# EAGLE design newrev (EAGLE 9.6.2)

## Sheet 1 of 2
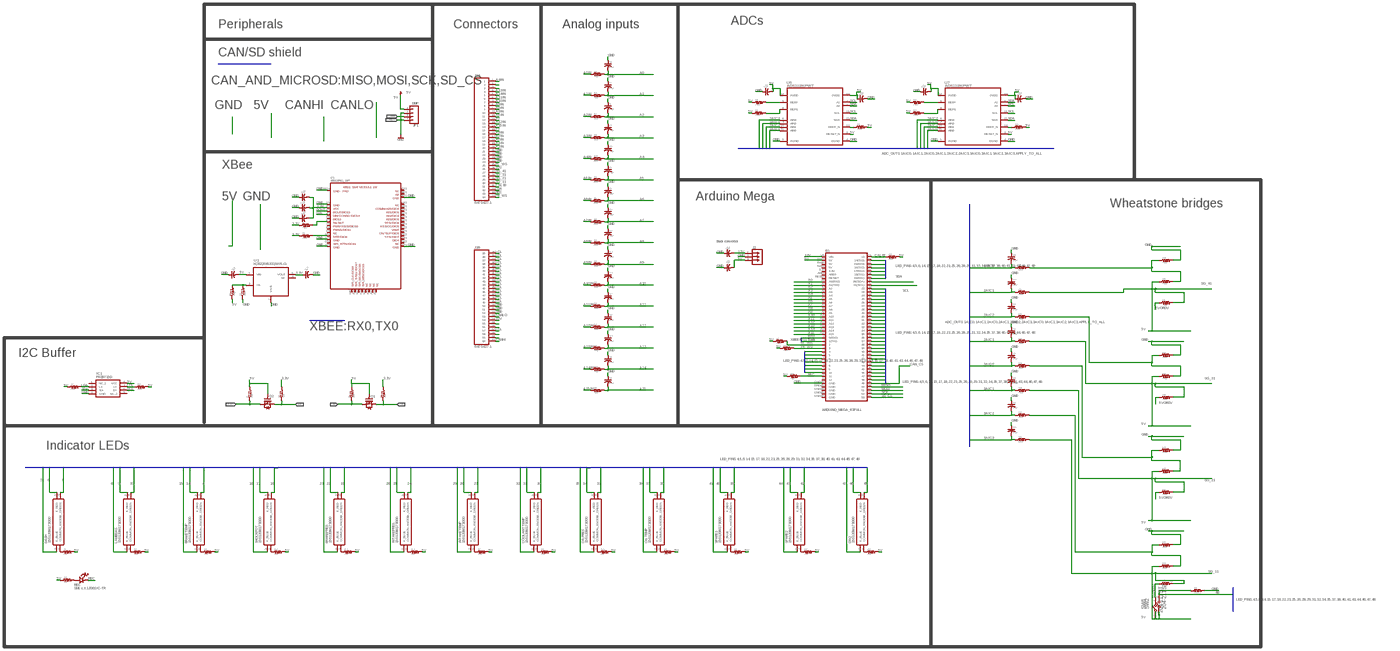
[diagram p0: schematic, sheet 1, overview]
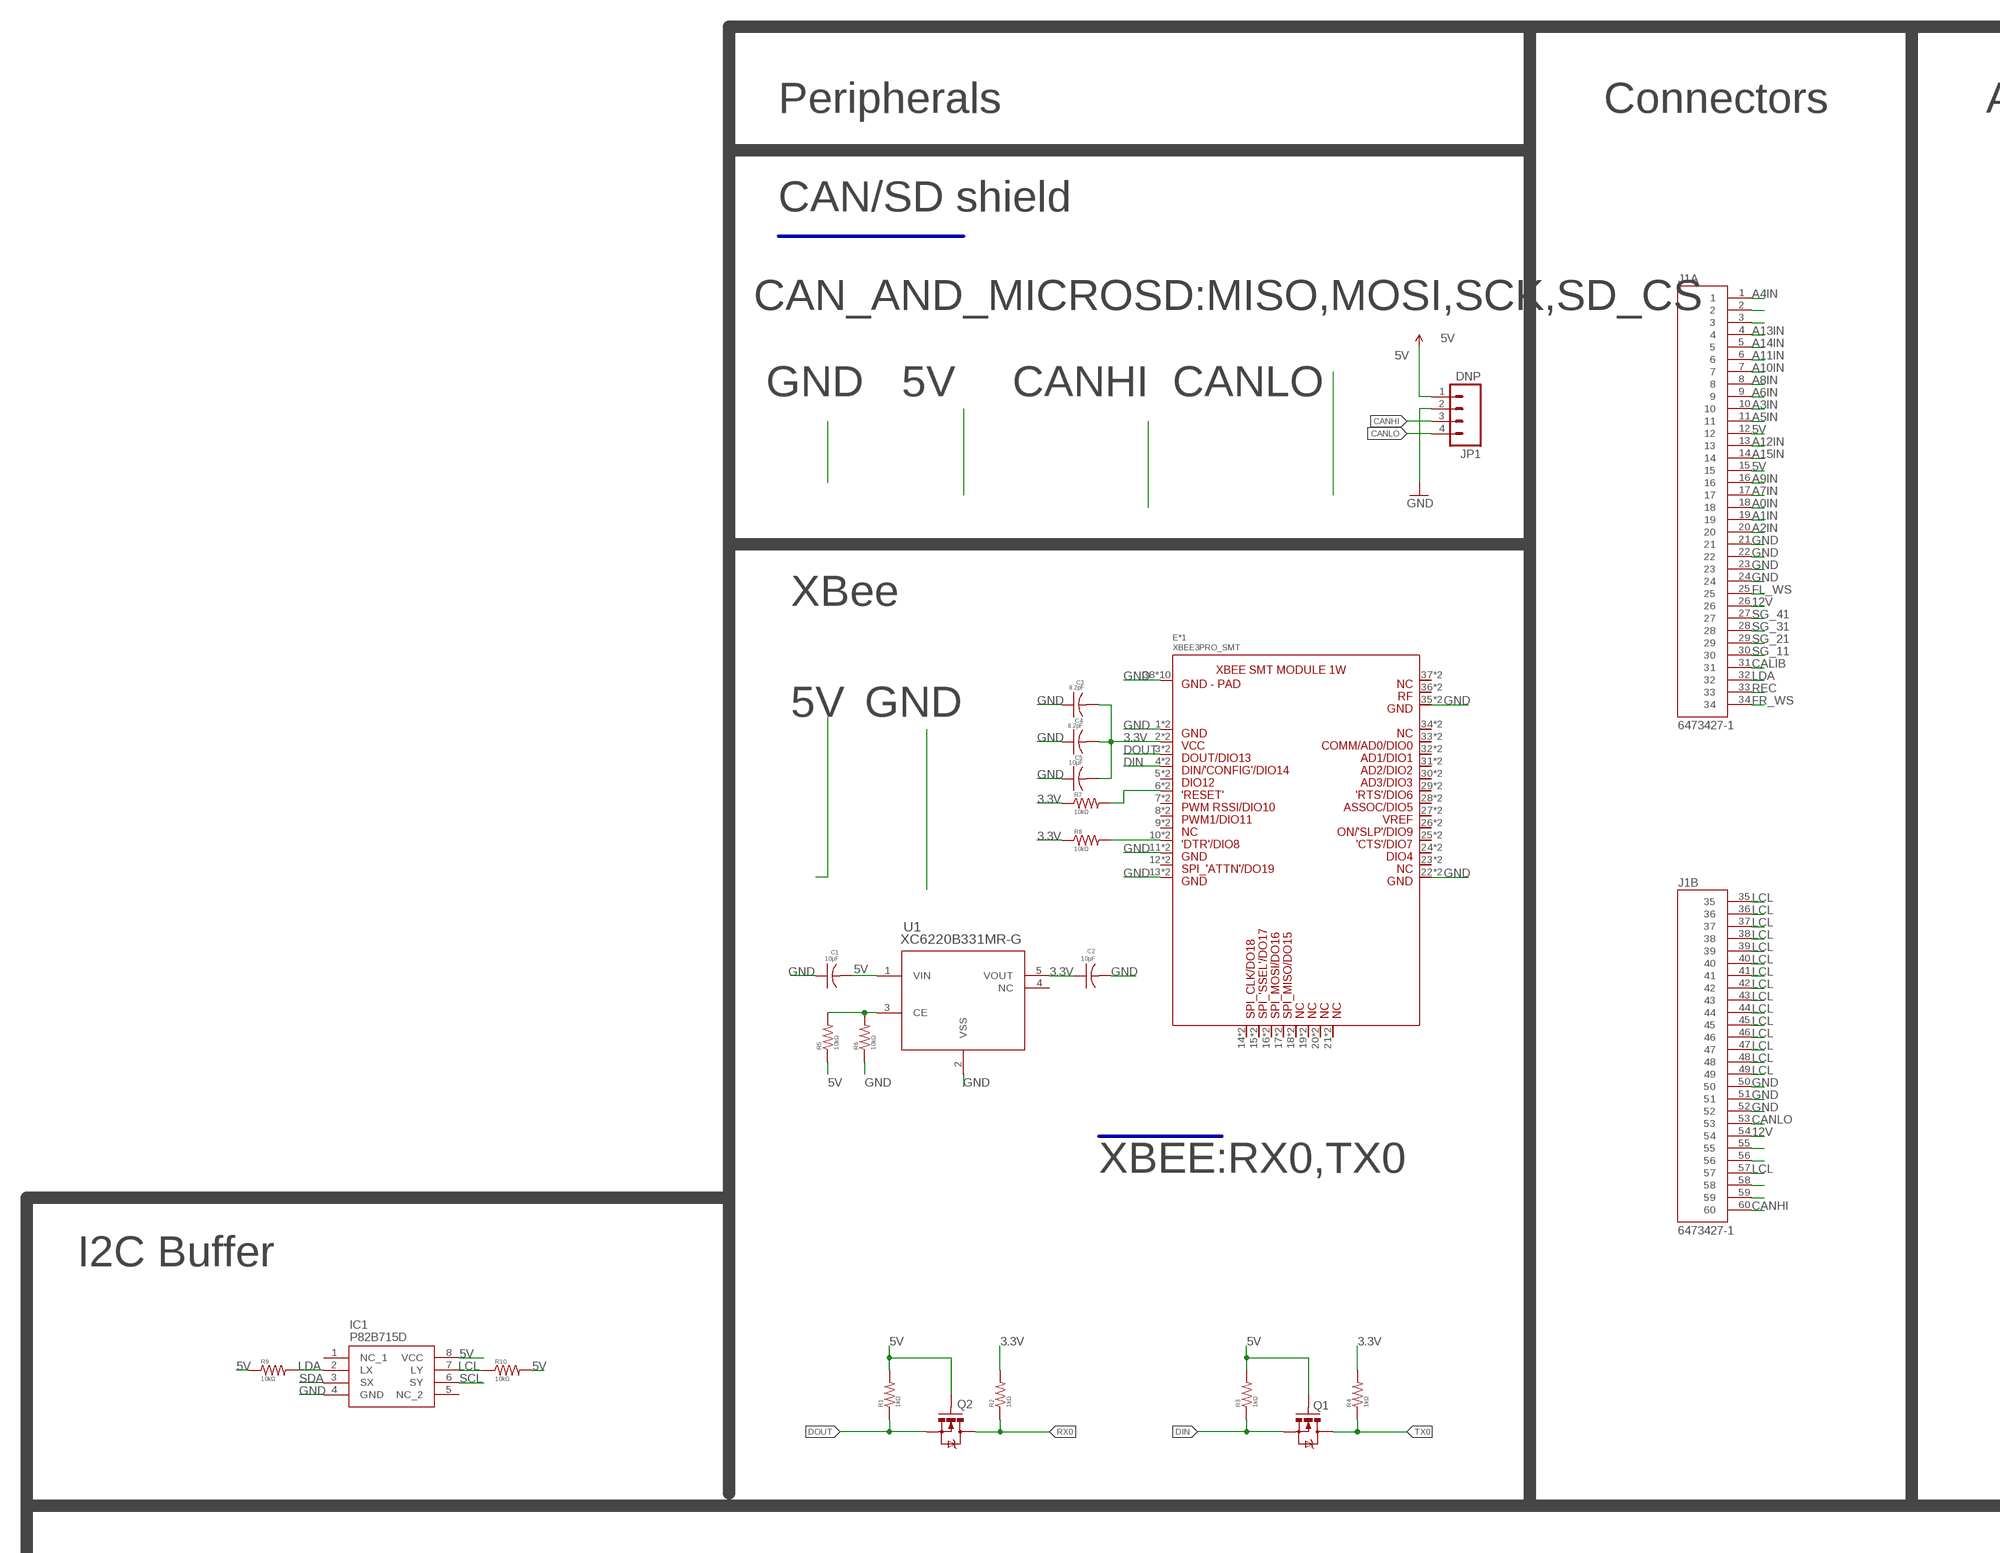
[diagram p1: schematic, sheet 1, part 1 of 5]
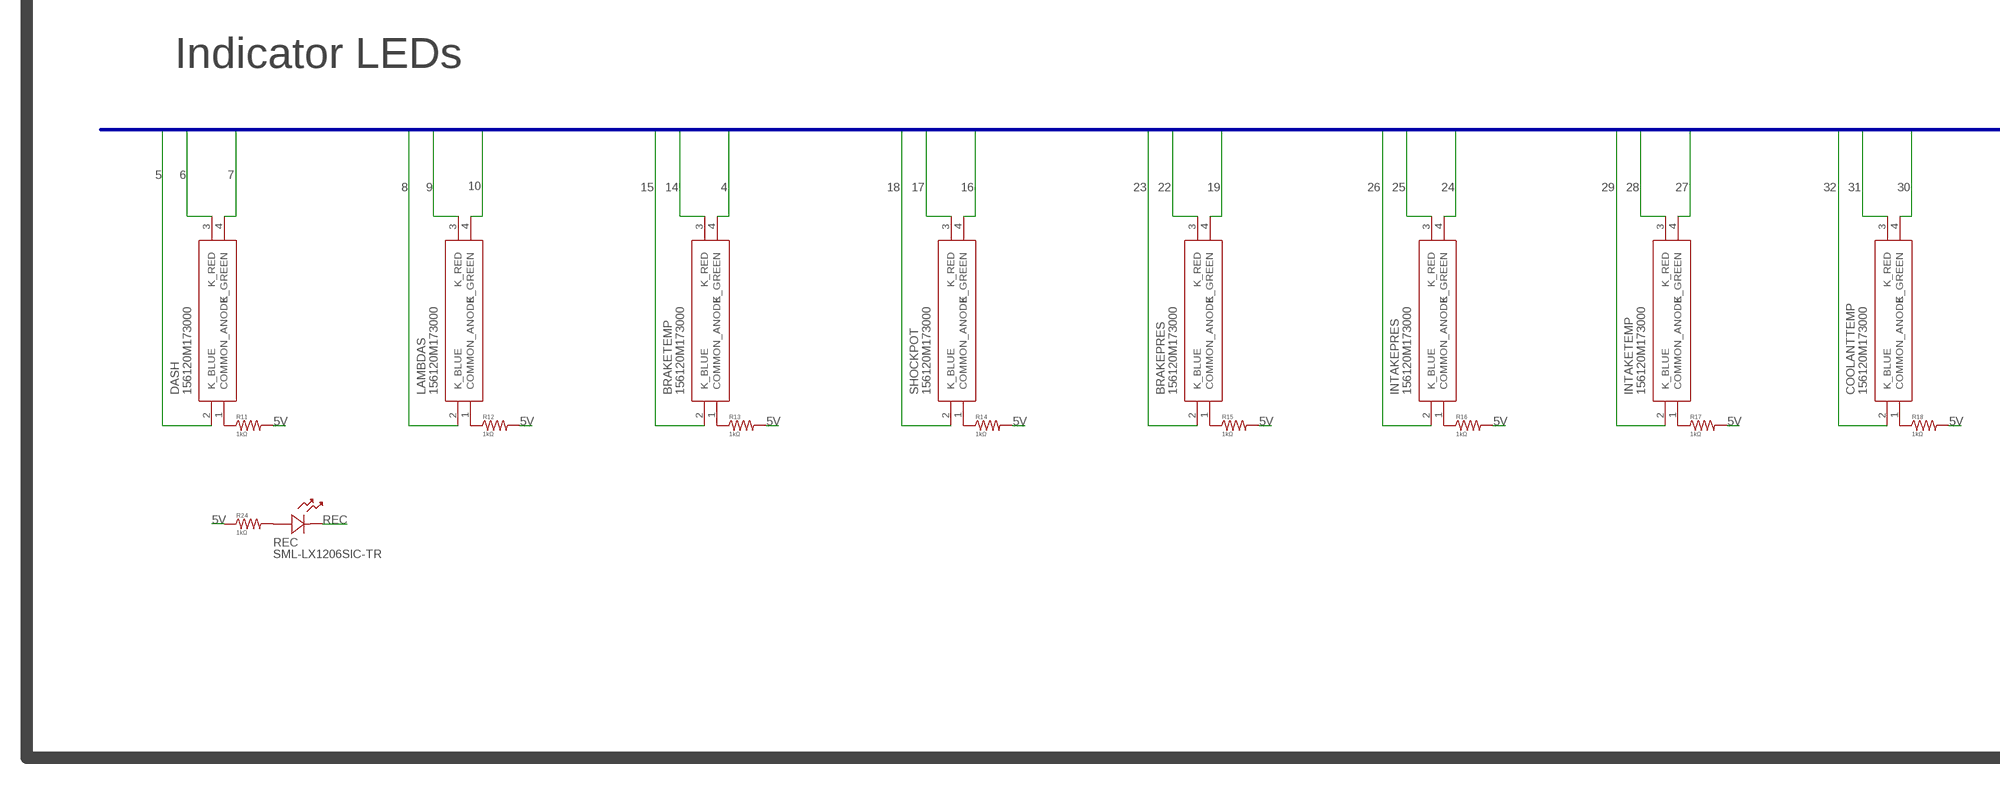
[diagram p2: schematic, sheet 1, part 2 of 5]
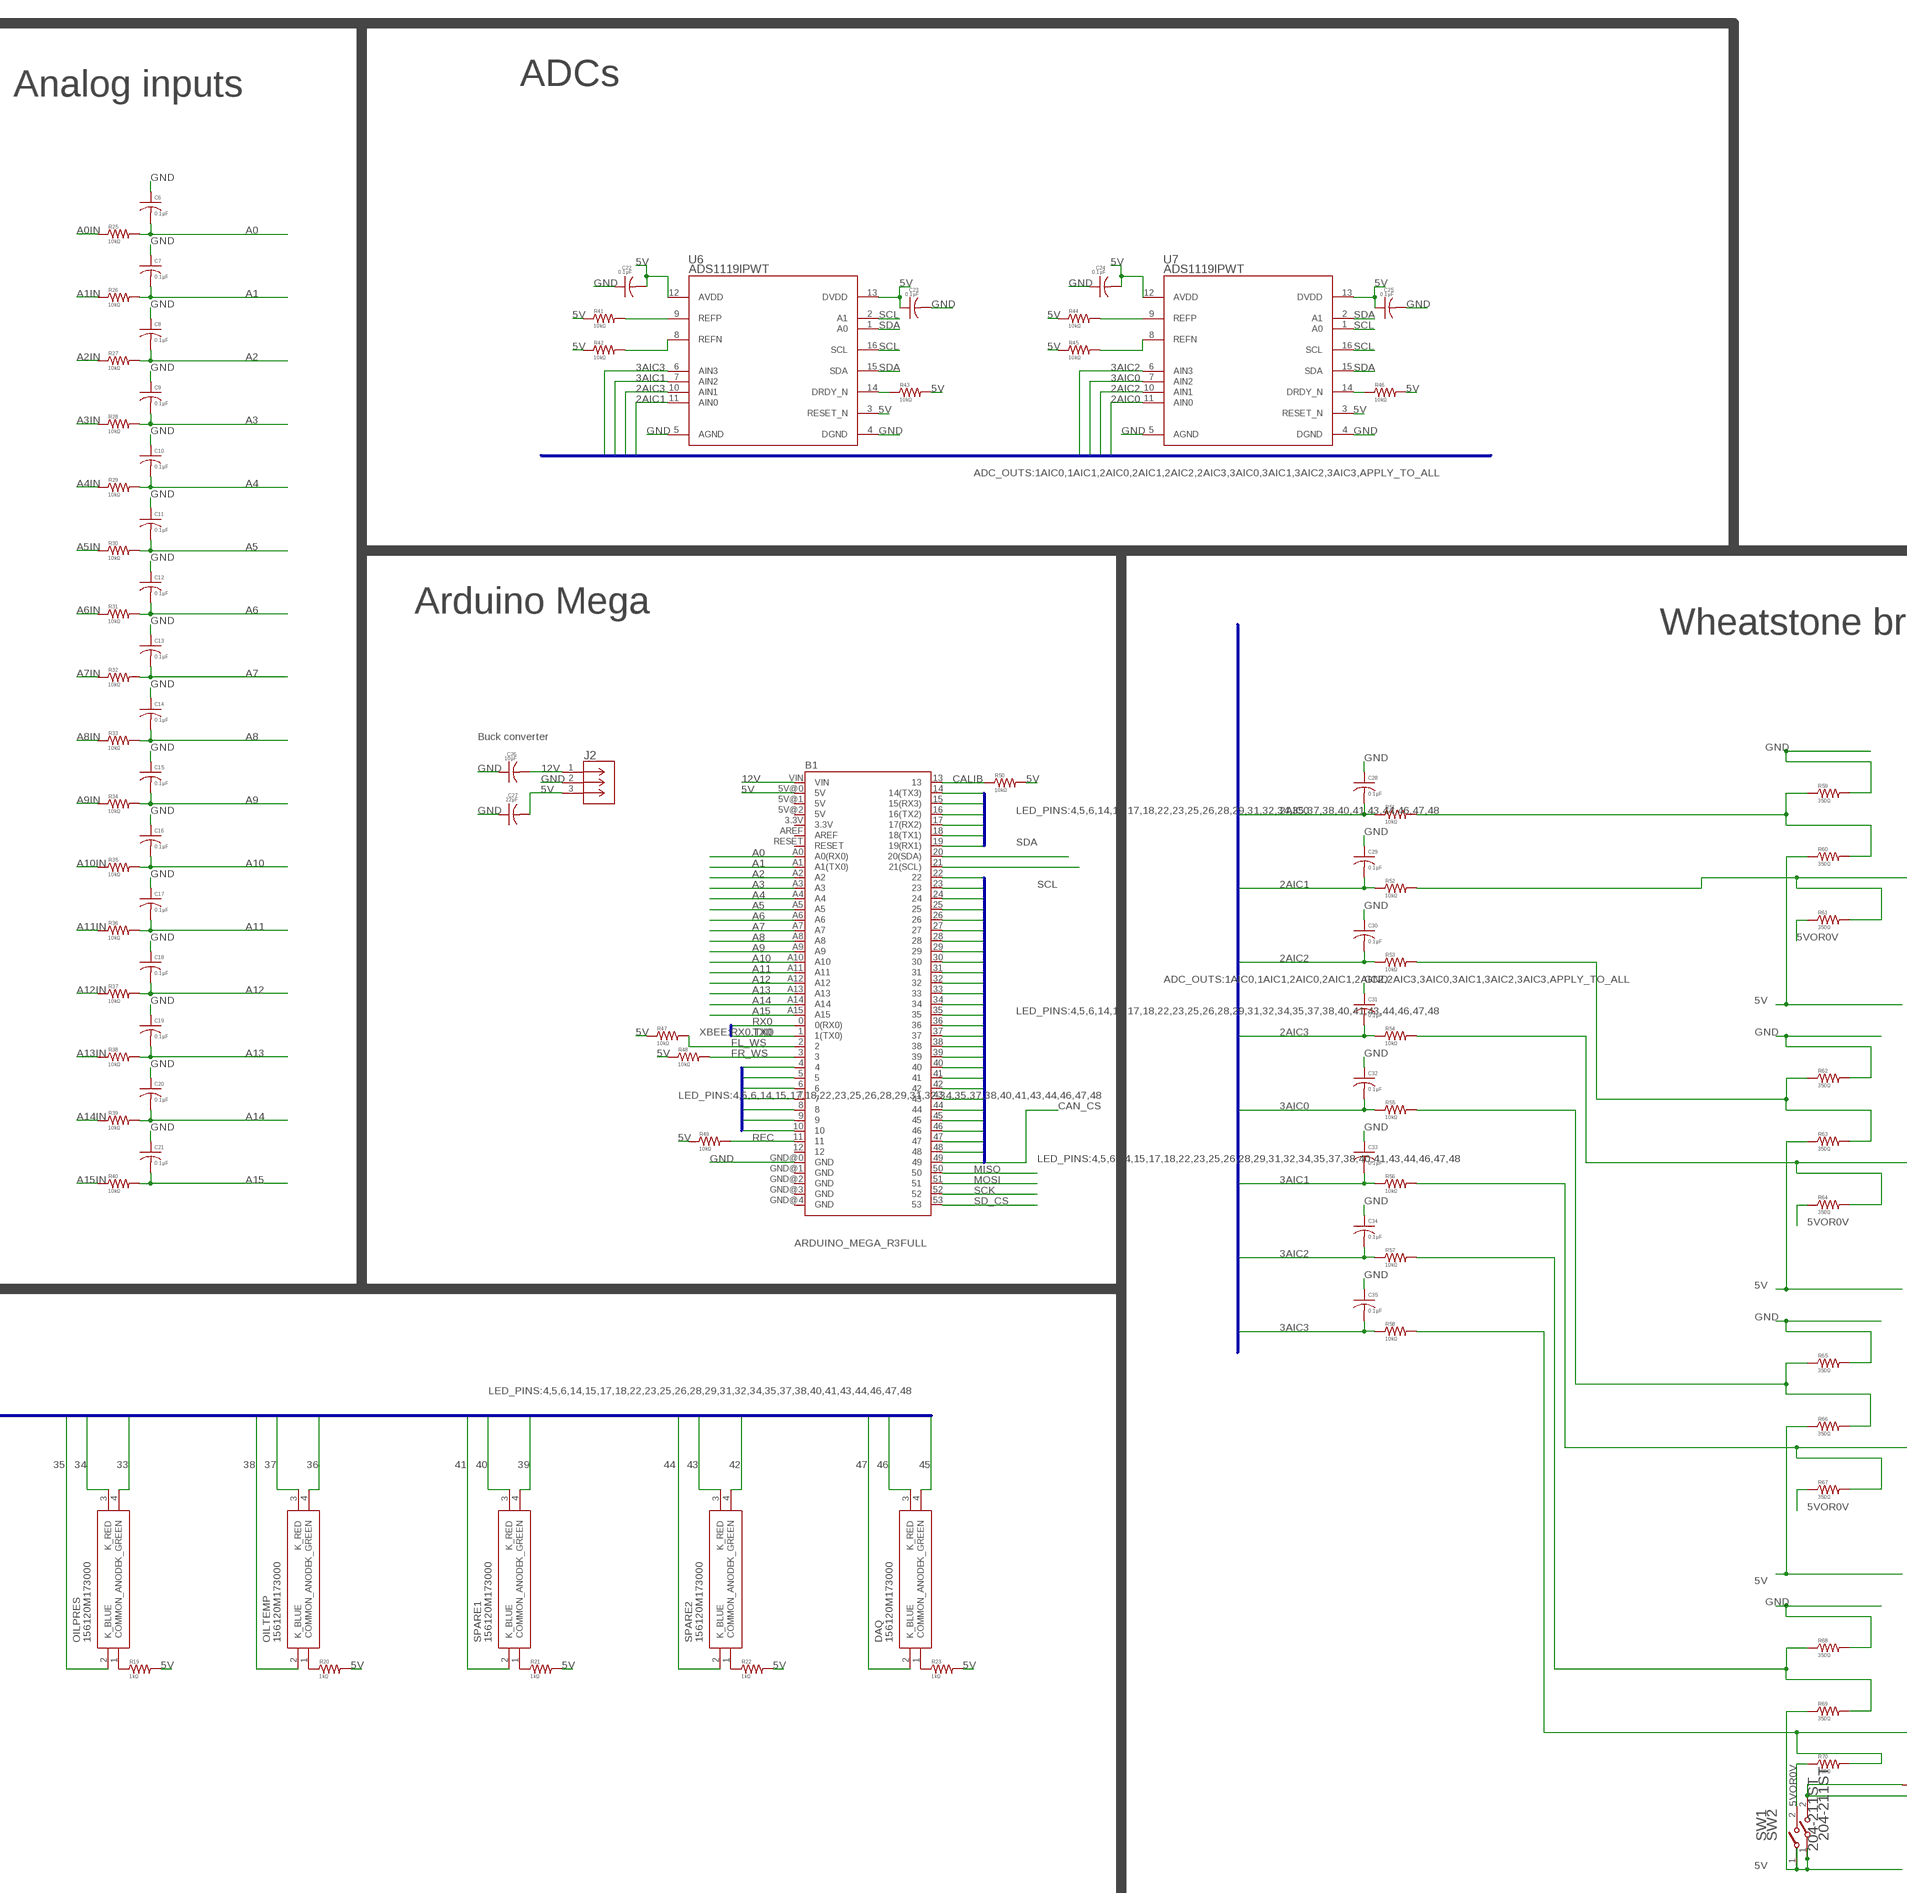
[diagram p3: schematic, sheet 1, part 3 of 5]
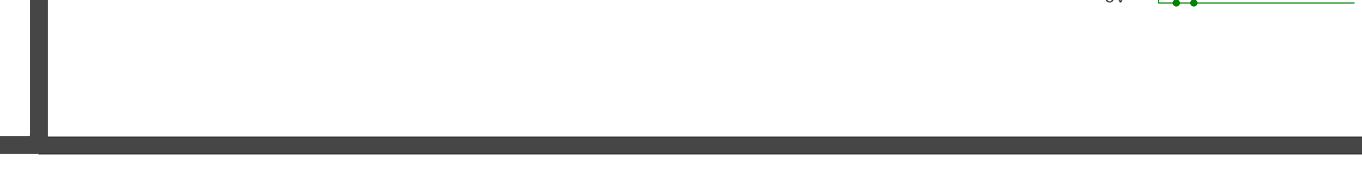
[diagram p4: schematic, sheet 1, part 4 of 5]
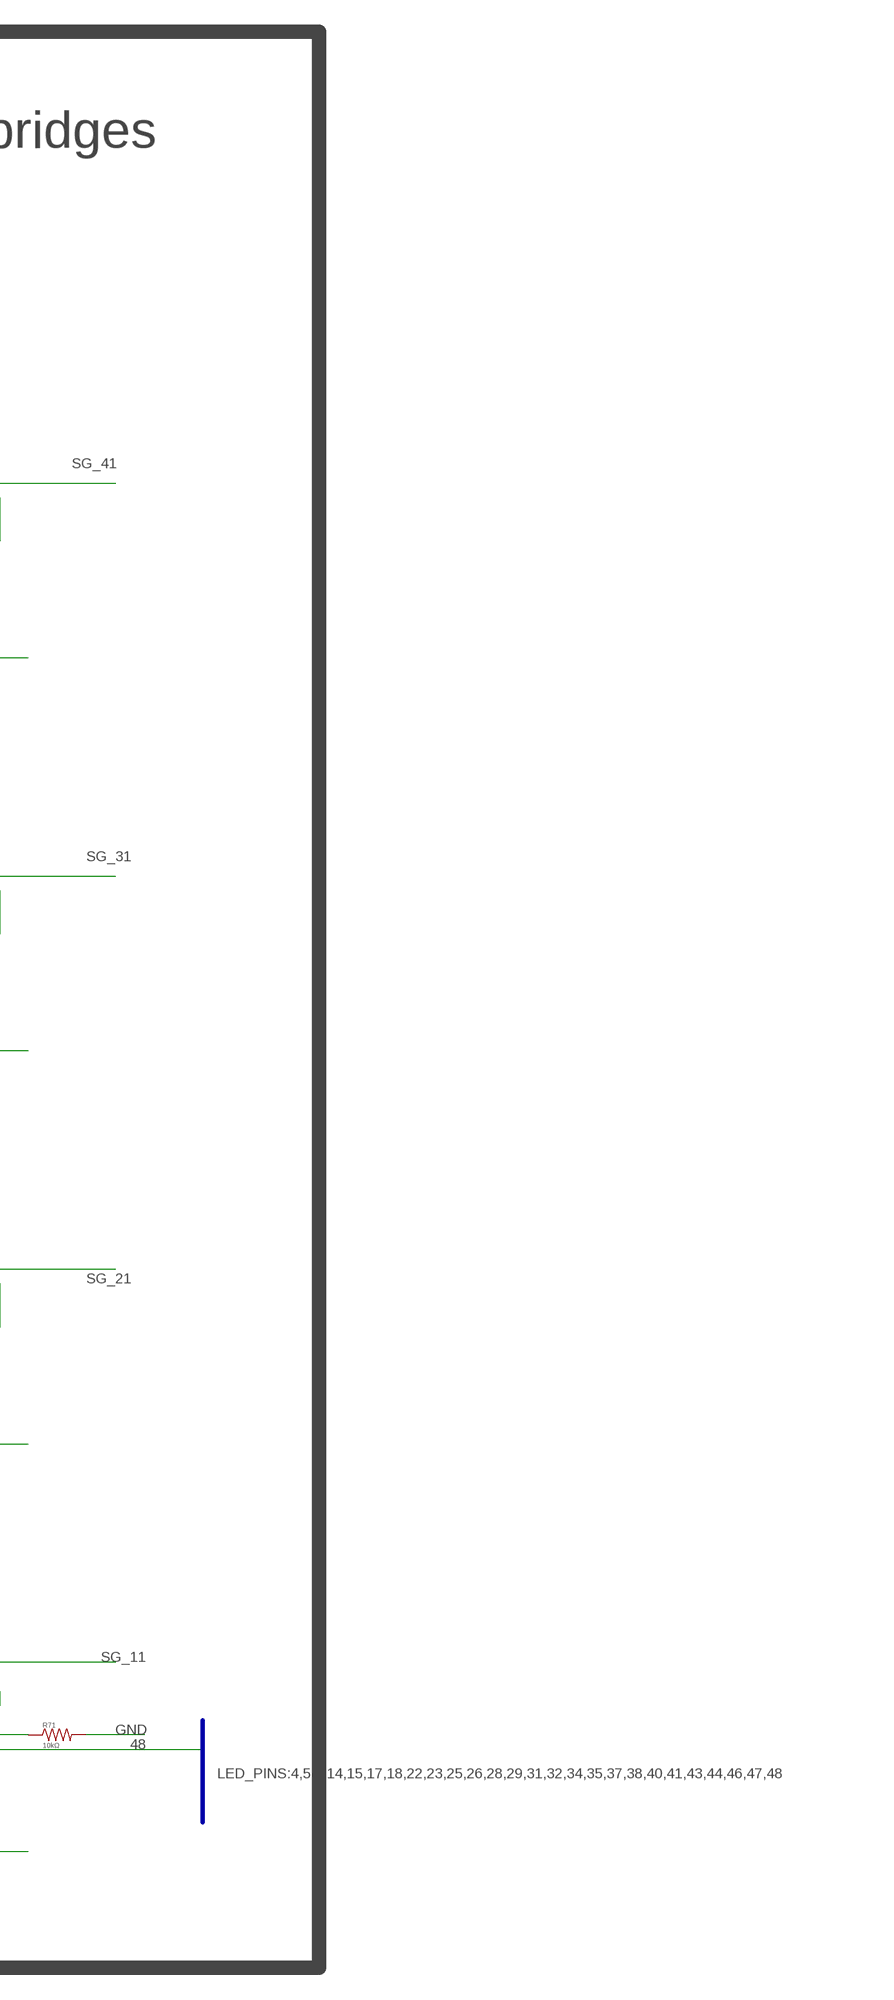
[diagram p5: schematic, sheet 1, part 5 of 5]

### Parts
B1  ARDUINO_MEGA_R3FULL  [ARDUINO_MEGA]
BRAKEPRES  156120M173000  [156120M173000]
BRAKETEMP  156120M173000  [156120M173000]
C1  10μF  C-USC1206  [C1206]
C2  10μF  C-USC1206  [C1206]
C3  8.2pF  C-USC1206  [C1206]
C4  8.2pF  C-USC1206  [C1206]
C5  10μF  C-USC1206  [C1206]
C6  0.1μF  C-USC1206  [C1206]
C7  0.1μF  C-USC1206  [C1206]
C8  0.1μF  C-USC1206  [C1206]
C9  0.1μF  C-USC1206  [C1206]
C10  0.1μF  C-USC1206  [C1206]
C11  0.1μF  C-USC1206  [C1206]
C12  0.1μF  C-USC1206  [C1206]
C13  0.1μF  C-USC1206  [C1206]
C14  0.1μF  C-USC1206  [C1206]
C15  0.1μF  C-USC1206  [C1206]
C16  0.1μF  C-USC1206  [C1206]
C17  0.1μF  C-USC1206  [C1206]
C18  0.1μF  C-USC1206  [C1206]
C19  0.1μF  C-USC1206  [C1206]
C20  0.1μF  C-USC1206  [C1206]
C21  0.1μF  C-USC1206  [C1206]
C22  0.1μF  C-USC1206  [C1206]
C23  0.1μF  C-USC1206  [C1206]
C24  0.1μF  C-USC1206  [C1206]
C25  0.1μF  C-USC1206  [C1206]
C26  10μF  C-USC1206  [C1206]
C27  22μF  C-USC1206  [C1206]
C28  0.1μF  C-USC1206  [C1206]
C29  0.1μF  C-USC1206  [C1206]
C30  0.1μF  C-USC1206  [C1206]
C31  0.1μF  C-USC1206  [C1206]
C32  0.1μF  C-USC1206  [C1206]
C33  0.1μF  C-USC1206  [C1206]
C34  0.1μF  C-USC1206  [C1206]
C35  0.1μF  C-USC1206  [C1206]
COOLANTTEMP  156120M173000  [156120M173000]
DAQ  156120M173000  [156120M173000]
DASH  156120M173000  [156120M173000]
E*1  XBEE3PRO_SMT  [XBEE3PRO_SMT_FOOTPRINT]
IC1  P82B715D  [SOIC127P600X175-8N]
INTAKEPRES  156120M173000  [156120M173000]
INTAKETEMP  156120M173000  [156120M173000]
J1  6473427-1  [TE_6473427-1]
J2  VR10S05  [CONN3_10S05_XPP]
JP1  DNP  M04PTH  [1X04]
LAMBDAS  156120M173000  [156120M173000]
OILPRES  156120M173000  [156120M173000]
OILTEMP  156120M173000  [156120M173000]
Q1  MOSFET-NCHANNELSMD  [SOT23-3]
Q2  MOSFET-NCHANNELSMD  [SOT23-3]
R1  1kΩ  R-US_R1206  [R1206]
R2  1kΩ  R-US_R1206  [R1206]
R3  1kΩ  R-US_R1206  [R1206]
R4  1kΩ  R-US_R1206  [R1206]
R5  10kΩ  R-US_R1206  [R1206]
R6  10kΩ  R-US_R1206  [R1206]
R7  10kΩ  R-US_R1206  [R1206]
R8  10kΩ  R-US_R1206  [R1206]
R9  10kΩ  R-US_R1206  [R1206]
R10  10kΩ  R-US_R1206  [R1206]
R11  1kΩ  R-US_R1206  [R1206]
R12  1kΩ  R-US_R1206  [R1206]
R13  1kΩ  R-US_R1206  [R1206]
R14  1kΩ  R-US_R1206  [R1206]
R15  1kΩ  R-US_R1206  [R1206]
R16  1kΩ  R-US_R1206  [R1206]
R17  1kΩ  R-US_R1206  [R1206]
R18  1kΩ  R-US_R1206  [R1206]
R19  1kΩ  R-US_R1206  [R1206]
R20  1kΩ  R-US_R1206  [R1206]
R21  1kΩ  R-US_R1206  [R1206]
R22  1kΩ  R-US_R1206  [R1206]
R23  1kΩ  R-US_R1206  [R1206]
R24  1kΩ  R-US_R1206  [R1206]
R25  10kΩ  R-US_R1206  [R1206]
R26  10kΩ  R-US_R1206  [R1206]
R27  10kΩ  R-US_R1206  [R1206]
R28  10kΩ  R-US_R1206  [R1206]
R29  10kΩ  R-US_R1206  [R1206]
R30  10kΩ  R-US_R1206  [R1206]
R31  10kΩ  R-US_R1206  [R1206]
R32  10kΩ  R-US_R1206  [R1206]
R33  10kΩ  R-US_R1206  [R1206]
R34  10kΩ  R-US_R1206  [R1206]
R35  10kΩ  R-US_R1206  [R1206]
R36  10kΩ  R-US_R1206  [R1206]
R37  10kΩ  R-US_R1206  [R1206]
R38  10kΩ  R-US_R1206  [R1206]
R39  10kΩ  R-US_R1206  [R1206]
R40  10kΩ  R-US_R1206  [R1206]
R41  10kΩ  R-US_R1206  [R1206]
R42  10kΩ  R-US_R1206  [R1206]
R43  10kΩ  R-US_R1206  [R1206]
R44  10kΩ  R-US_R1206  [R1206]
R45  10kΩ  R-US_R1206  [R1206]
R46  10kΩ  R-US_R1206  [R1206]
R47  10kΩ  R-US_R1206  [R1206]
R48  10kΩ  R-US_R1206  [R1206]
R49  10kΩ  R-US_R1206  [R1206]
R50  10kΩ  R-US_R1206  [R1206]
R51  10kΩ  R-US_R1206  [R1206]
R52  10kΩ  R-US_R1206  [R1206]
R53  10kΩ  R-US_R1206  [R1206]
R54  10kΩ  R-US_R1206  [R1206]
R55  10kΩ  R-US_R1206  [R1206]
R56  10kΩ  R-US_R1206  [R1206]
R57  10kΩ  R-US_R1206  [R1206]
R58  10kΩ  R-US_R1206  [R1206]
R59  350Ω  R-US_R1206  [R1206]
R60  350Ω  R-US_R1206  [R1206]
R61  350Ω  R-US_R1206  [R1206]
R62  350Ω  R-US_R1206  [R1206]
R63  350Ω  R-US_R1206  [R1206]
R64  350Ω  R-US_R1206  [R1206]
R65  350Ω  R-US_R1206  [R1206]
R66  350Ω  R-US_R1206  [R1206]
R67  350Ω  R-US_R1206  [R1206]
R68  350Ω  R-US_R1206  [R1206]
R69  350Ω  R-US_R1206  [R1206]
R70  350Ω  R-US_R1206  [R1206]
R71  10kΩ  R-US_R1206  [R1206]
REC  SML-LX1206SIC-TR  [LED_SML-LX1206SIC-TR_LUM]
SHOCKPOT  156120M173000  [156120M173000]
SPARE1  156120M173000  [156120M173000]
SPARE2  156120M173000  [156120M173000]
SW1  CTS_ELECTROCOMPONENTS_204-211STCTS_ELECTROCOMPONENTS_204-211ST_0_0  [CTS_ELECTROCOMPONENTS_204-211ST_0]
SW2  CTS_ELECTROCOMPONENTS_204-211STCTS_ELECTROCOMPONENTS_204-211ST_0_0  [CTS_ELECTROCOMPONENTS_204-211ST_0]
U1  XC6220B331MR-G  [SOT-25_TOR]
U6  ADS1119IPWT  [PW0016A_N]
U7  ADS1119IPWT  [PW0016A_N]

### Nets
2AIC0: C28.2 R51.1 U7.11(AIN0)
2AIC1: C29.2 R52.1 U6.11(AIN0)
2AIC2: C30.2 R53.1 U7.10(AIN1)
2AIC3: C31.2 R54.1 U6.10(AIN1)
3.3V: C2.1 C3.2 C4.2 C5.2 E*1.2 E*1.2-1 R2.2 R4.2 R7.1 R8.1 U1.5(VOUT) ; also sheet 2
3AIC0: C32.2 R55.1 U7.7(AIN2)
3AIC1: C33.2 R56.1 U6.7(AIN2)
3AIC2: C34.2 R57.1 U7.6(AIN3)
3AIC3: C35.2 R58.1 U6.6(AIN3)
4: B1.4 BRAKETEMP.4(K_GREEN)
5: B1.5 DASH.2(K_BLUE)
5V: B1.5V@0(5V) C1.2 C22.2 C23.1 C24.2 C25.1 C27.2 IC1.8(VCC) J1.12 J1.15 J2.3 JP1.1 Q1.1(G) Q2.1(G) R1.2 R3.2 R5.1 R9.1 R10.2 R11.2 R12.2 R13.2 R14.2 R15.2 R16.2 R17.2 R18.2 R19.2 R20.2 R21.2 R22.2 R23.2 R24.1 R41.1 R42.1 R43.2 R44.1 R45.1 R46.2 R47.1 R48.1 R49.1 R50.2 R60.1 R63.1 R66.1 R69.1 SW1.1 SW2.1 U1.1(VIN) U6.3(RESET_N) U6.12(AVDD) U6.13(DVDD) U7.3(RESET_N) U7.12(AVDD) U7.13(DVDD) ; also sheet 2
5VOR0V: R61.1 R64.1 R67.1 R70.1 SW1.2
6: B1.6 DASH.3(K_RED)
7: B1.7 DASH.4(K_GREEN)
8: B1.8 LAMBDAS.2(K_BLUE)
9: B1.9 LAMBDAS.3(K_RED)
10: B1.10 LAMBDAS.4(K_GREEN)
12V: B1.VIN C26.2 J1.26 J1.54 J2.1
14: B1.14(14(TX3)) BRAKETEMP.3(K_RED)
15: B1.15(15(RX3)) BRAKETEMP.2(K_BLUE)
16: B1.16(16(TX2)) SHOCKPOT.4(K_GREEN)
17: B1.17(17(RX2)) SHOCKPOT.3(K_RED)
18: B1.18(18(TX1)) SHOCKPOT.2(K_BLUE)
19: B1.19(19(RX1)) BRAKEPRES.4(K_GREEN)
22: B1.22 BRAKEPRES.3(K_RED)
23: B1.23 BRAKEPRES.2(K_BLUE)
24: B1.24 INTAKEPRES.4(K_GREEN)
25: B1.25 INTAKEPRES.3(K_RED)
26: B1.26 INTAKEPRES.2(K_BLUE)
27: B1.27 INTAKETEMP.4(K_GREEN)
28: B1.28 INTAKETEMP.3(K_RED)
29: B1.29 INTAKETEMP.2(K_BLUE)
30: B1.30 COOLANTTEMP.4(K_GREEN)
31: B1.31 COOLANTTEMP.3(K_RED)
32: B1.32 COOLANTTEMP.2(K_BLUE)
33: B1.33 OILPRES.4(K_GREEN)
34: B1.34 OILPRES.3(K_RED)
35: B1.35 OILPRES.2(K_BLUE)
36: B1.36 OILTEMP.4(K_GREEN)
37: B1.37 OILTEMP.3(K_RED)
38: B1.38 OILTEMP.2(K_BLUE)
39: B1.39 SPARE1.4(K_GREEN)
40: B1.40 SPARE1.3(K_RED)
41: B1.41 SPARE1.2(K_BLUE)
42: B1.42 SPARE2.4(K_GREEN)
43: B1.43 SPARE2.3(K_RED)
44: B1.44 SPARE2.2(K_BLUE)
45: B1.45 DAQ.4(K_GREEN)
46: B1.46 DAQ.3(K_RED)
47: B1.47 DAQ.2(K_BLUE)
48: B1.48 R71.1 SW2.2
A0: B1.A0(A0(RX0)) C6.2 R25.2
A0IN: J1.18 R25.1
A1: B1.A1(A1(TX0)) C7.2 R26.2
A1IN: J1.19 R26.1
A2: B1.A2 C8.2 R27.2
A2IN: J1.20 R27.1
A3: B1.A3 C9.2 R28.2
A3IN: J1.10 R28.1
A4: B1.A4 C10.2 R29.2
A4IN: J1.1 R29.1
A5: B1.A5 C11.2 R30.2
A5IN: J1.11 R30.1
A6: B1.A6 C12.2 R31.2
A6IN: J1.9 R31.1
A7: B1.A7 C13.2 R32.2
A7IN: J1.17 R32.1
A8: B1.A8 C14.2 R33.2
A8IN: J1.8 R33.1
A9: B1.A9 C15.2 R34.2
A9IN: J1.16 R34.1
A10: B1.A10 C16.2 R35.2
A10IN: J1.7 R35.1
A11: B1.A11 C17.2 R36.2
A11IN: J1.6 R36.1
A12: B1.A12 C18.2 R37.2
A12IN: J1.13 R37.1
A13: B1.A13 C19.2 R38.2
A13IN: J1.4 R38.1
A14: B1.A14 C20.2 R39.2
A14IN: J1.5 R39.1
A15: B1.A15 C21.2 R40.2
A15IN: J1.14 R40.1
CALIB: B1.13 J1.31 R50.1
CAN_CS: B1.49 ; also sheet 2
CANHI: J1.60 JP1.3
CANLO: J1.53 JP1.4
DIN: E*1.4 E*1.4-1 Q1.2(S) R3.1
DOUT: E*1.3 E*1.3-1 Q2.2(S) R1.1
FL_WS: B1.2 J1.25 R47.2
FR_WS: B1.3 J1.34 R48.2
GND: B1.GND@0(GND) C1.1 C2.2 C3.1 C4.1 C5.1 C6.1 C7.1 C8.1 C9.1 C10.1 C11.1 C12.1 C13.1 C14.1 C15.1 C16.1 C17.1 C18.1 C19.1 C20.1 C21.1 C22.1 C23.2 C24.1 C25.2 C26.1 C27.1 C28.1 C29.1 C30.1 C31.1 C32.1 C33.1 C34.1 C35.1 E*1.1 E*1.1-1 E*1.11 E*1.11-1 E*1.13 E*1.13-1 E*1.22 E*1.22-1 E*1.35 E*1.35-1 E*1.38 E*1.38-1 E*1.38-2 E*1.38-3 E*1.38-4 E*1.38-5 E*1.38-6 E*1.38-7 E*1.38-8 E*1.38-9 IC1.4(GND) J1.21 J1.22 J1.23 J1.24 J1.50 J1.51 J1.52 J2.2 JP1.2 R6.1 R59.2 R62.2 R65.2 R68.2 R71.2 U1.2(VSS) U6.4(DGND) U6.5(AGND) U7.4(DGND) U7.5(AGND) ; also sheet 2
LCL: IC1.7(LY) J1.35 J1.36 J1.37 J1.38 J1.39 J1.40 J1.41 J1.42 J1.43 J1.44 J1.45 J1.46 J1.47 J1.48 J1.49 J1.57 R10.1
LDA: IC1.2(LX) J1.32 R9.2
MISO: B1.50 ; also sheet 2
MOSI: B1.51 ; also sheet 2
N$1: INTAKEPRES.1(COMMON_ANODE) R16.1
N$2: R5.2 R6.2 U1.3(CE)
N$4: DASH.1(COMMON_ANODE) R11.1
N$5: INTAKETEMP.1(COMMON_ANODE) R17.1
N$6: COOLANTTEMP.1(COMMON_ANODE) R18.1
N$7: OILPRES.1(COMMON_ANODE) R19.1
N$8: OILTEMP.1(COMMON_ANODE) R20.1
N$9: R21.1 SPARE1.1(COMMON_ANODE)
N$10: R22.1 SPARE2.1(COMMON_ANODE)
N$11: DAQ.1(COMMON_ANODE) R23.1
N$12: R24.2 REC.2
N$13: E*1.10 E*1.10-1 R8.2
N$14: J1.58
N$15: R43.1 U6.14(DRDY_N)
N$16: E*1.6 E*1.6-1 R7.2
N$17: LAMBDAS.1(COMMON_ANODE) R12.1
N$18: BRAKETEMP.1(COMMON_ANODE) R13.1
N$19: R14.1 SHOCKPOT.1(COMMON_ANODE)
N$20: BRAKEPRES.1(COMMON_ANODE) R15.1
N$24: R51.2 R59.1 R60.2
N$32: R53.2 R62.1 R63.2
N$35: R46.1 U7.14(DRDY_N)
N$36: J1.55
N$37: J1.56
N$38: J1.59
N$39: J1.2
N$40: R55.2 R65.1 R66.2
N$41: J1.3
N$42: R41.2 U6.9(REFP)
N$43: R42.2 U6.8(REFN)
N$44: R44.2 U7.9(REFP)
N$45: R45.2 U7.8(REFN)
N$47: R57.2 R68.1 R69.2
REC: B1.11 J1.33 R49.2 REC.1
RX0: B1.0(0(RX0)) Q2.3(D) R2.1
SCK: B1.52 ; also sheet 2
SCL: B1.21(21(SCL)) IC1.6(SY) U6.2(A1) U6.16(SCL) U7.1(A0) U7.16(SCL)
SD_CS: B1.53 ; also sheet 2
SDA: B1.20(20(SDA)) IC1.3(SX) U6.1(A0) U6.15(SDA) U7.2(A1) U7.15(SDA)
SG_11: J1.30 R58.2 R70.2
SG_21: J1.29 R56.2 R67.2
SG_31: J1.28 R54.2 R64.2
SG_41: J1.27 R52.2 R61.2
TX0: B1.1(1(TX0)) Q1.3(D) R4.1
Unconnected: B1.3.3V B1.5V@1(5V) B1.5V@2(5V) B1.12 B1.AREF B1.GND@1(GND) B1.GND@2(GND) B1.GND@3(GND) B1.GND@4(GND) B1.RESET E*1.5 E*1.5-1 E*1.7 E*1.7-1 E*1.8 E*1.8-1 E*1.9 E*1.9-1 E*1.12 E*1.12-1 E*1.14 E*1.14-1 E*1.15 E*1.15-1 E*1.16 E*1.16-1 E*1.17 E*1.17-1 E*1.18 E*1.18-1 E*1.19 E*1.19-1 E*1.20 E*1.20-1 E*1.21 E*1.21-1 E*1.23 E*1.23-1 E*1.24 E*1.24-1 E*1.25 E*1.25-1 E*1.26 E*1.26-1 E*1.27 E*1.27-1 E*1.28 E*1.28-1 E*1.29 E*1.29-1 E*1.30 E*1.30-1 E*1.31 E*1.31-1 E*1.32 E*1.32-1 E*1.33 E*1.33-1 E*1.34 E*1.34-1 E*1.36 E*1.36-1 E*1.37 E*1.37-1 IC1.1(NC_1) IC1.5(NC_2) U1.4(NC)

### Buses
ADC_OUTS:1AIC0,1AIC1,2AIC0,2AIC1,2AIC2,2AIC3,3AIC0,3AIC1,3AIC2,3AIC3,APPLY_TO_ALL
CAN_AND_MICROSD:MISO,MOSI,SCK,SD_CS
XBEE:RX0,TX0
LED_PINS:4,5,6,14,15,17,18,22,23,25,26,28,29,31,32,34,35,37,38,40,41,43,44,46,47,48

### Notes on the sheet
- Peripherals | Connectors | Analog inputs | ADCs
- CAN/SD shield
- XBee
- Arduino Mega
- Wheatstone bridges
- Buck converter
- I2C Buffer
- Indicator LEDs

## Sheet 2 of 2
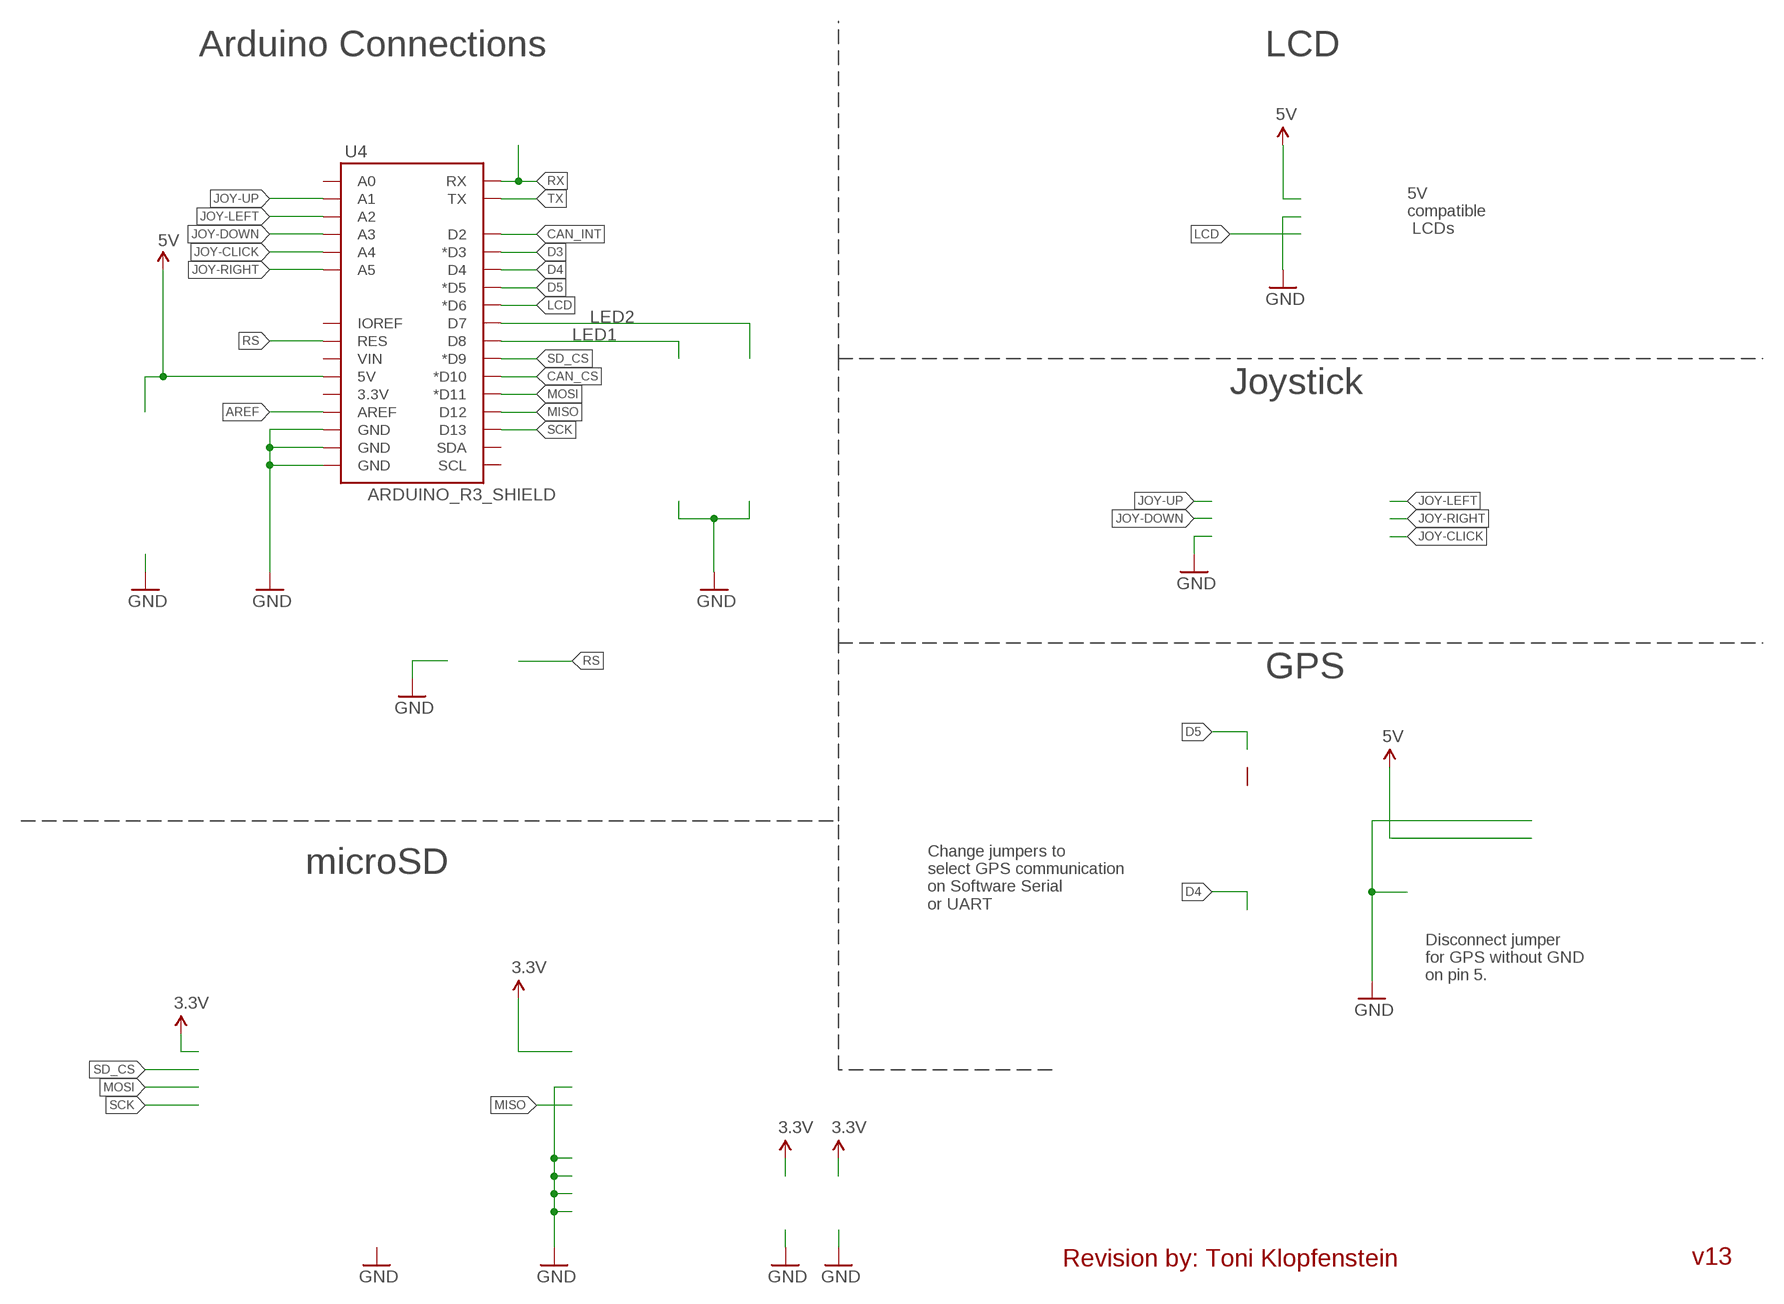
[diagram p6: schematic, sheet 2]

### Parts
U4  ARDUINO_R3_SHIELD  [UNO_R3_SHIELD]

### Nets
5V: U4.5V ; also sheet 1
AREF: U4.AREF
CAN_CS: U4.D10(*D10) ; also sheet 1
CAN_INT: U4.D2
D3: U4.D3(*D3)
D4: U4.D4
D5: U4.D5(*D5)
GND: U4.GND@0(GND) U4.GND@1(GND) U4.GND@2(GND) ; also sheet 1
JOY-CLICK: U4.A4
JOY-DOWN: U4.A3
JOY-LEFT: U4.A2
JOY-RIGHT: U4.A5
JOY-UP: U4.A1
LCD: U4.D6(*D6)
LED1: U4.D8
LED2: U4.D7
MISO: U4.D12 ; also sheet 1
MOSI: U4.D11(*D11) ; also sheet 1
RS: U4.RES
RX: U4.RX
SCK: U4.D13 ; also sheet 1
SD_CS: U4.D9(*D9) ; also sheet 1
TX: U4.TX
Unconnected: U4.3.3V U4.A0 U4.IOREF U4.SCL U4.SDA U4.VIN

### Notes on the sheet
- Arduino Connections | LCD
- 5V 
  compatible
   LCDs
- Joystick
- GPS
- microSD
- Change jumpers to 
  select GPS communication
  on Software Serial 
  or UART
- Disconnect jumper
  for GPS without GND
  on pin 5.
- Revision by: Toni Klopfenstein | v13

## Library data of the parts
B1 = SparkFun-Boards:ARDUINO_MEGA_R3: Arduino Mega R3 ATmega2560 R3 compatible footprint. SparkFun Products: Arduino Mega 2560 R3 <https://www.sparkfun.com/products/11061>
BRAKEPRES BRAKETEMP COOLANTTEMP DAQ DASH INTAKEPRES INTAKETEMP LAMBDAS OILPRES OILTEMP SHOCKPOT SPARE1 SPARE2 = SamacSys_Parts:156120M173000: 2.4 V, 3.6 V RGB LED 3216 (1206) SMD, Wurth Elektronik WL-SFRW 156120M173000 Source: Datasheet <https://katalog.we-online.de/led/datasheet/156120M173000.pdf>; DESCRIPTION: 2.4 V, 3.6 V RGB LED 3216 (1206) SMD, Wurth Elektronik WL-SFRW 156120M173000; HEIGHT: 1.25mm; MANUFACTURER_NAME: Wurth Elektronik; MANUFACTURER_PART_NUMBER: 156120M173000; MOUSER_PART_NUMBER: 710-156120M173000; MOUSER_PRICE-STOCK: https://www.mouser.co.uk/ProductDetail/Wurth-Elektronik/156120M173000?qs=u16ybLDytRY9pBY8Z%2Fs7dQ%3D%3D
C1-C35 = 1206cap:C-US; SPICEPREFIX: C
E*1 = xbee3pro_smt:XBEE3PRO_SMT: XBEE SMT MODULE 1W
IC1 = SamacSys_Parts:P82B715D: Texas Instruments P82B715D, Dual, Bus Buffer, 4.5 12 V, 8-Pin SOIC Source: Datasheet <http://componentsearchengine.com/Datasheets/3/P82B715D.pdf>; DESCRIPTION: Texas Instruments P82B715D, Dual, Bus Buffer, 4.5 12 V, 8-Pin SOIC; HEIGHT: 1.75mm; MANUFACTURER_NAME: Texas Instruments; MANUFACTURER_PART_NUMBER: P82B715D; MOUSER_PART_NUMBER: 595-P82B715D; MOUSER_PRICE-STOCK: https://www.mouser.co.uk/ProductDetail/Texas-Instruments/P82B715D?qs=ToK3%2FczOkx%2Fmhyx%252Bp5%2FQZw%3D%3D
J1 = 6473427-1:6473427-1: CONN RECPT 60POS R/A 3MM AU Check prices <https://pricing.snapeda.com/parts/6473427-1/TE%20Connectivity/view-part?ref=eda>; AVAILABILITY: In Stock; COMMENT: 6473427-1; DESCRIPTION: Conn Wire to Board PIN 3mm Solder RA Thru-Hole; EU_ROHS_COMPLIANCE: Compliant; MF: TE Connectivity; MP: 6473427-1; PACKAGE: None; PRICE: None; PURCHASE-URL: https://pricing.snapeda.com/search/part/6473427-1/?ref=eda
J2 = VR10S05:VR10S05; COPYRIGHT: Copyright (C) 2022 Ultra Librarian. All rights reserved.; DIGI-KEY_PART_NUMBER_1: 1470-VR10S05-ND; MANUFACTURER_PART_NUMBER: VR10S05; MFR_NAME: XP Power
JP1 = SparkFun-Connectors:M04: Header 4 Standard 4-pin 0.1" header. Use with straight break away headers (SKU : PRT-00116), right angle break away headers (PRT-00553), swiss pins (PRT-00743), machine pins (PRT-00117), and female headers (PRT-00115). Molex polarized connector foot print use with SKU : PRT-08231 with associated crimp pins and housings. 1MM SMD Version SKU: PRT-10208
Q1 Q2 = SparkFun-DiscreteSemi:MOSFET-NCHANNEL: Generic NMOS footprint
R1-R71 = 1206res:R-US_
REC = SML-LX1206SIC-TR:SML-LX1206SIC-TR; COPYRIGHT: Copyright (C) 2021 Ultra Librarian. All rights reserved.; DIGI-KEY_PART_NUMBER_1: 67-1695-2-ND; DIGI-KEY_PART_NUMBER_2: 67-1695-1-ND; DIGI-KEY_PART_NUMBER_3: 67-1695-6-ND; DIGI-KEY_PART_NUMBER_4: 67-1695-2-NDL; MANUFACTURER_PART_NUMBER: SML-LX1206SIC-TR; MFR_NAME: Lumex
SW1 SW2 = CTS Electrocomponents - 204-211ST:CTS_ELECTROCOMPONENTS_204-211ST: SWITCH SLIDE DIP DPST 50MA 24V; AUTOMOTIVE: No; CENTROID_NOT_SPECIFIED: No; CONTACT_CURRENT_RATING: 50mA; CONTACT_RESISTANCE: 50mΩ; DATASHEET: https://www.ctscorp.com/wp-content/uploads/204.pdf; DEVICE_CLASS_L1: Electromechanical; DEVICE_CLASS_L2: Switches; DEVICE_CLASS_L3: DIP Switches; DIGIKEY_DESCRIPTION: SWITCH SLIDE DIP DPST 50MA 24V; DIGIKEY_PART_NUMBER: CT3103CT-ND; ELECTROMECHANICAL_LIFE: 5000Cycles; FOOTPRINT_VARIANT_NAME_0: Recommended_Land_Pattern; HEIGHT: 10.36mm; LEAD_FREE: Yes; MF: CTS Electrocomponents; MFG_PACKAGE_IDENT: 204-211; MFG_PACKAGE_IDENT_DATE: 0; MFG_PACKAGE_IDENT_REV: 0; MOUSER_DESCRIPTION: DIP Switches / SIP Switches DPST 1 position Epoxy Top Tape Seal; MOUSER_PART_NUMBER: 774-204-211STR; MPN: 204-211ST; NUMBER_OF_CIRCUITS: 1; PACKAGE: SMT_SWITCH_9MM78_7MM26; PREFIX: SW; ROHS: Yes; TEMPERATURE_RANGE_HIGH: +85°C; TEMPERATURE_RANGE_LOW: -55°C; THROW_CONFIGURATION: DPST; VERIFICATION_VERSION: 0.0.0.1; VOLTAGE_RATING_DC: 24V
U1 = XC6220B331MR-G:XC6220B331MR-G; COPYRIGHT: Copyright (C) 2022 Ultra Librarian. All rights reserved.; DIGI-KEY_PART_NUMBER_1: 893-1133-1-ND; DIGI-KEY_PART_NUMBER_2: 893-1133-2-ND; DIGI-KEY_PART_NUMBER_3: 893-1133-6-ND; MANUFACTURER_PART_NUMBER: XC6220B331MR-G; MFR_NAME: Torex Semiconductor
U4 = SparkFun-Boards:ARDUINO_R3_SHIELD: Shield form compatible with the Arduino Uno R3.
U6 U7 = ADS1119IPWT:ADS1119IPWT; COPYRIGHT: Copyright (C) 2021 Ultra Librarian. All rights reserved.; DIGI-KEY_PART_NUMBER_1: 296-50287-1-ND; DIGI-KEY_PART_NUMBER_2: 296-50287-2-ND; DIGI-KEY_PART_NUMBER_3: 296-50287-6-ND; MANUFACTURER_PART_NUMBER: ADS1119IPWT; MFR_NAME: Texas Instruments; REFDES: RefDes; TYPE: TYPE

## Board
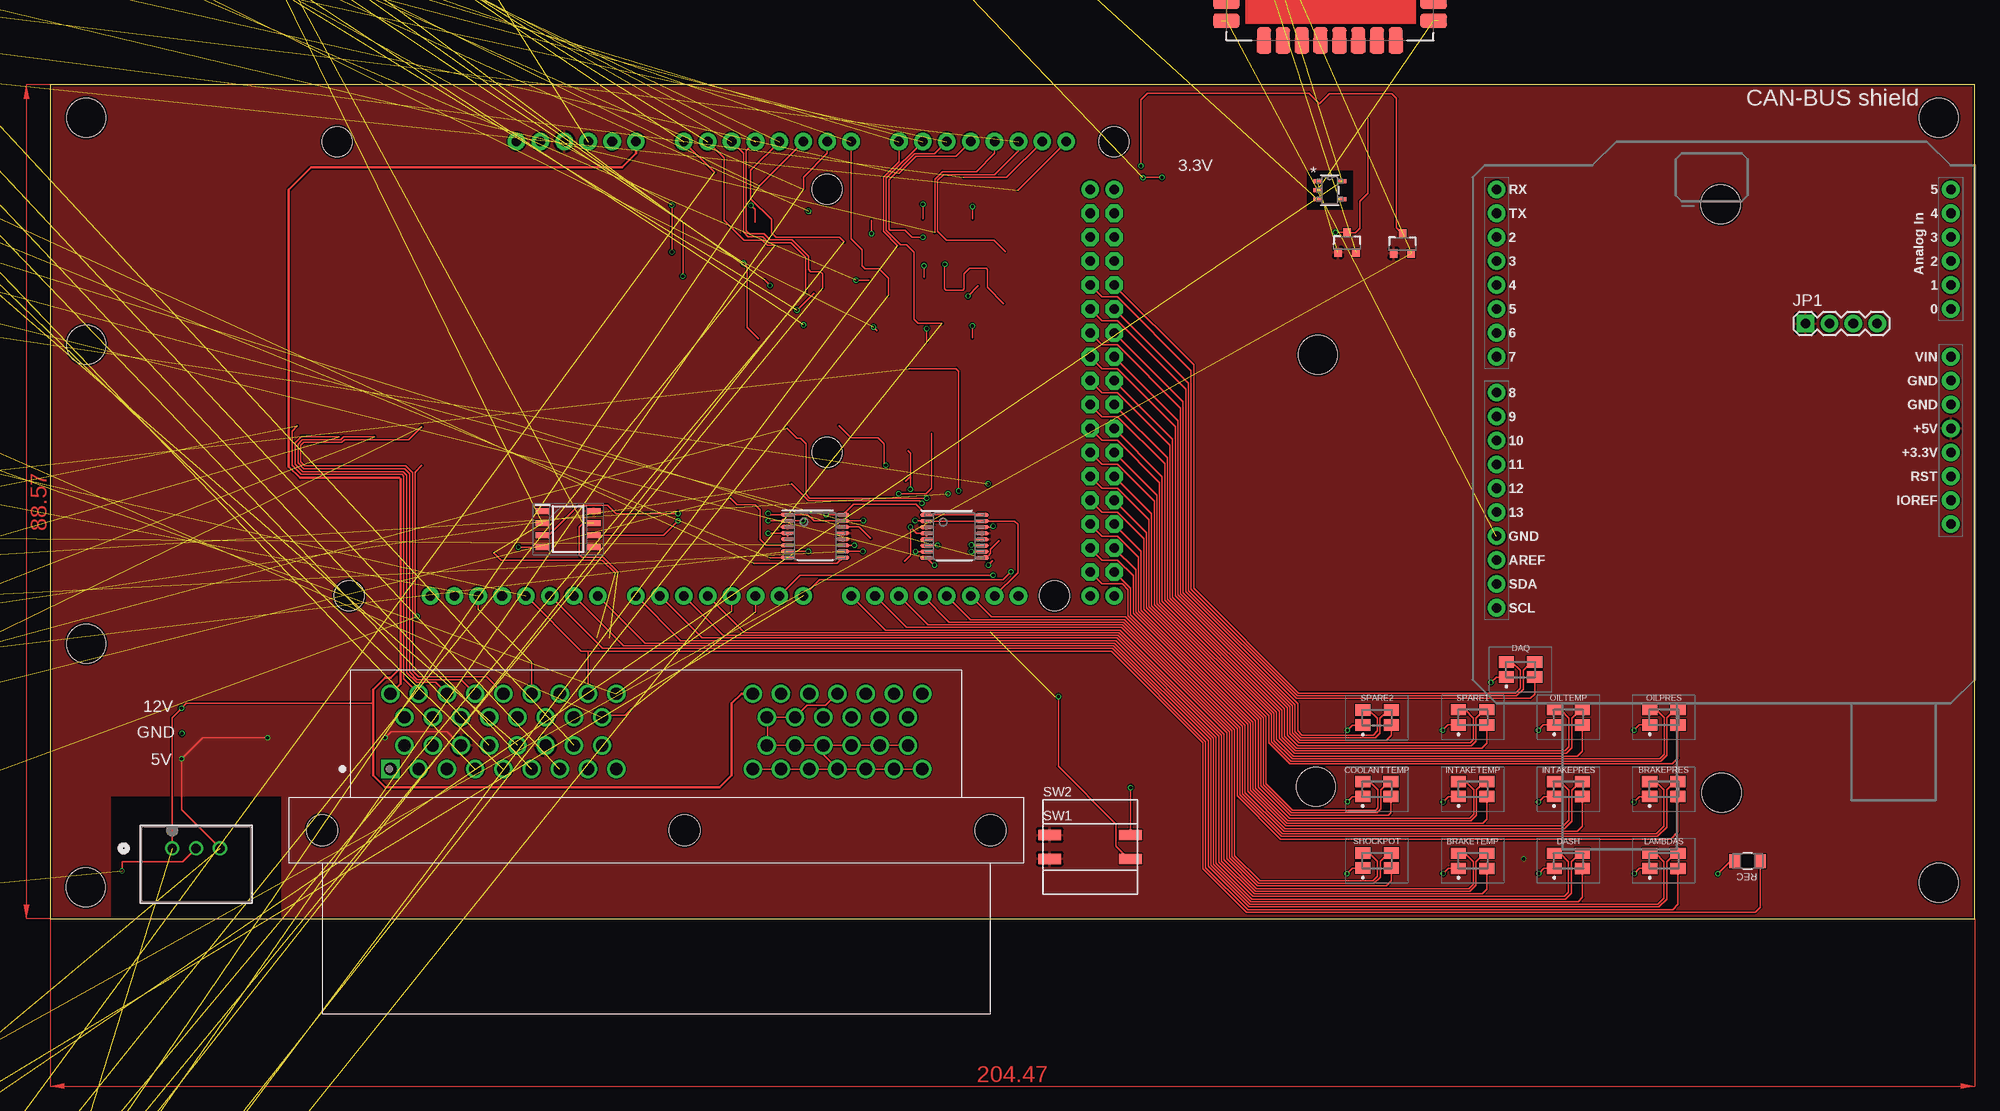
[diagram p7: board, top side]
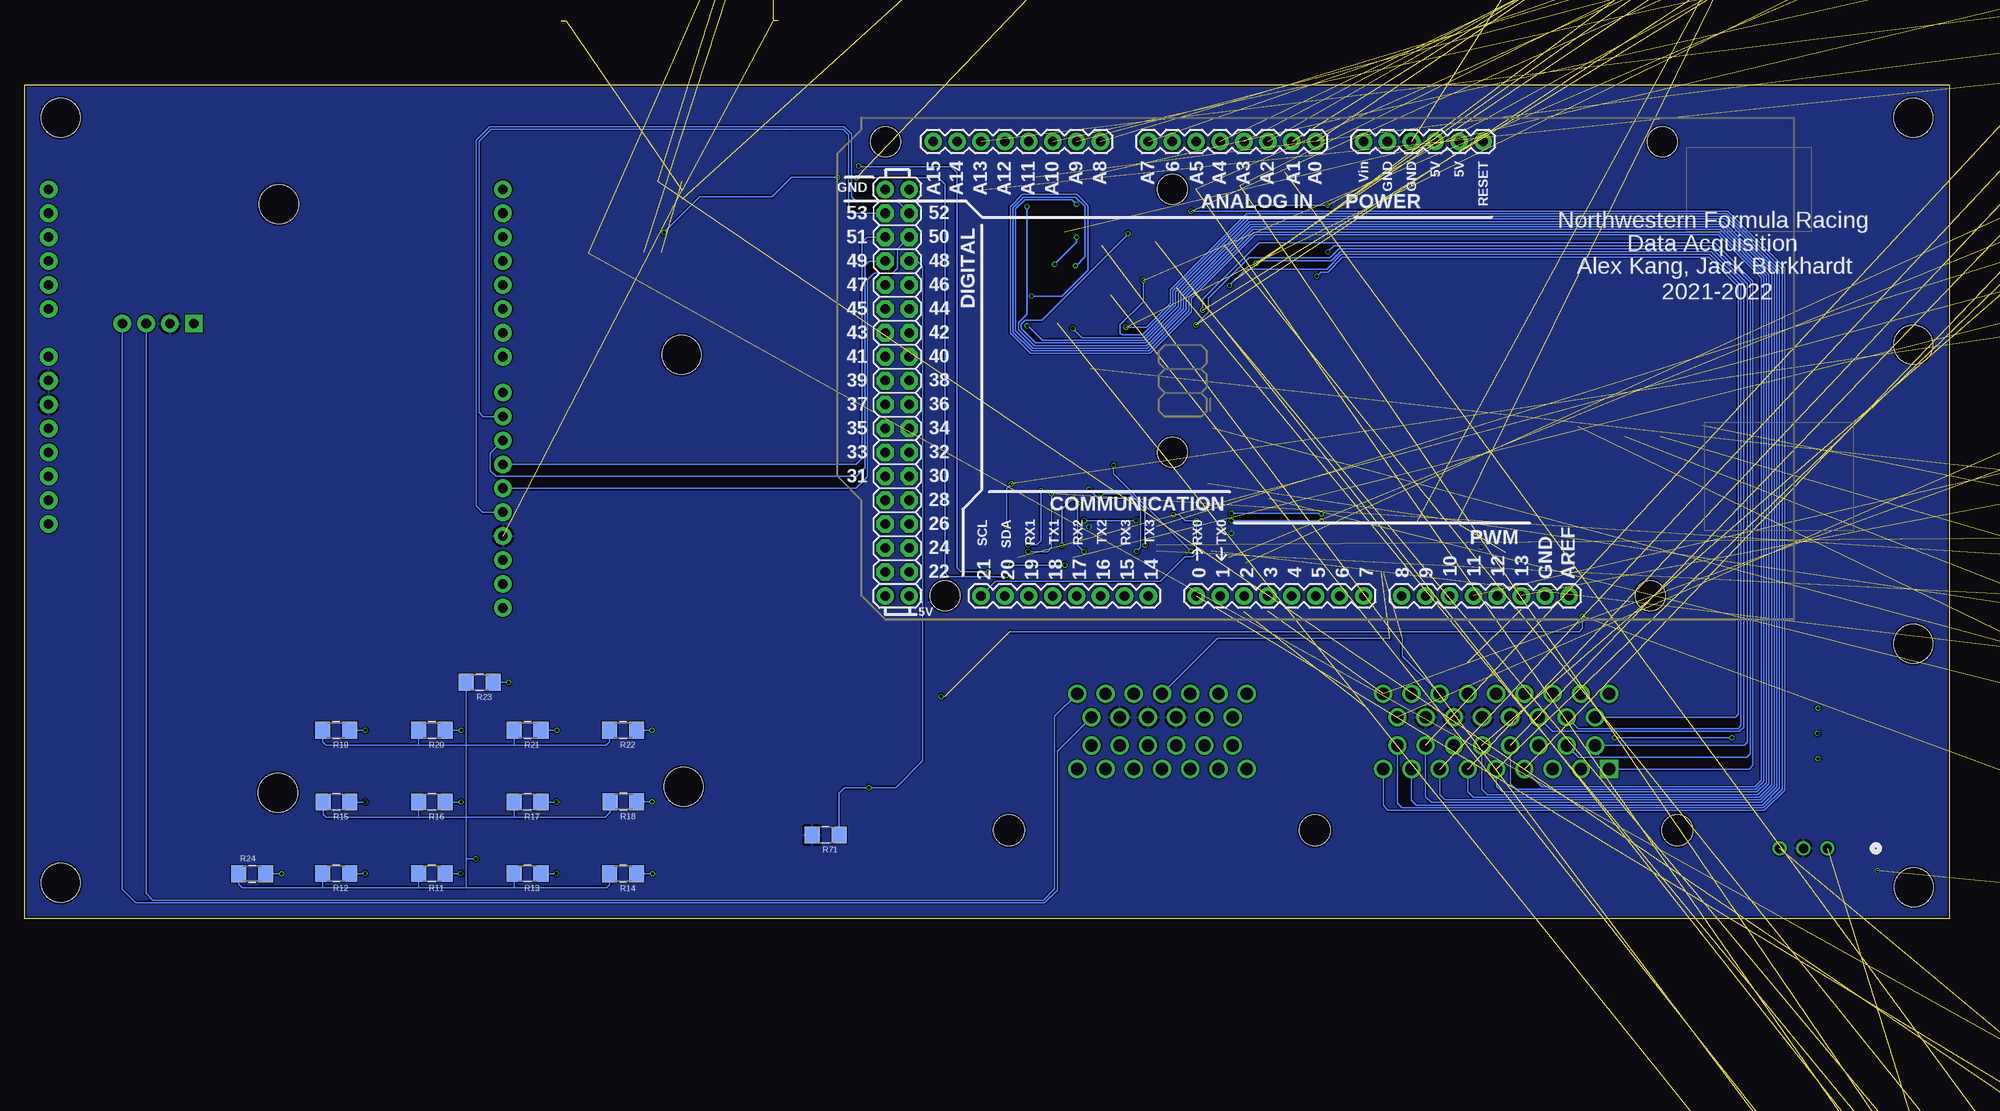
[diagram p8: board, bottom side, seen from below]

Size 204.45 x 88.57 mm. Coordinates in mm from the lower left corner, seen from the top.
Outline: 0,0 204.45,0 204.45,88.57 0,88.57 0,0
Copper layers (1*16): Top 0.035559375mm / dielectric 1.6mm / Bottom 0.035559375mm
Design rules "jlcpcb2layer": minimum track width 5mil, minimum drill 12mil, track to track 5mil, track to pad 5mil, pad to pad 5mil, via to via 5mil, smd to smd 5mil, copper to edge 8mil, drill to drill 6mil, minimum pad ring 5mil, minimum via ring 3mil, stop-mask expansion 2.5mil, vias tented up to drill 0mil, thermal gap 10mil
Holes 4.17 mm at 134.67,59.89 134.47,14.02 177.57,13.39 177.47,75.9 3.81,85.09 3.76,3.35 200.66,3.81 200.66,85.09 3.81,29.21 3.81,60.96

### Footprints (pad centres in the part's own frame; a part is rotated, then mirrored left to right if it is on the bottom)
ARDUINO_MEGA = drill 1.016 pad 1.88: 0 13.97,24.13; 1 11.43,24.13; 2 8.89,24.13; 3 6.35,24.13; 3.3V -13.97,-24.13; 4 3.81,24.13; 5 1.27,24.13; 5V@0 -11.43,-24.13; 5V@1 44.45,24.13; 5V@2 46.99,24.13; 6 -1.27,24.13; 7 -3.81,24.13; 8 -7.874,24.13; 9 -10.414,24.13; 10 -12.954,24.13; 11 -15.494,24.13; 12 -18.034,24.13; 13 -20.574,24.13; 14 19.05,24.13; 15 21.59,24.13; 16 24.13,24.13; 17 26.67,24.13; 18 29.21,24.13; 19 31.75,24.13; 20 34.29,24.13; 21 36.83,24.13; A0 1.27,-24.13; A1 3.81,-24.13; A2 6.35,-24.13; A3 8.89,-24.13; A4 11.43,-24.13; A5 13.97,-24.13; A6 16.51,-24.13; A7 19.05,-24.13; A8 24.13,-24.13; A9 26.67,-24.13; A10 29.21,-24.13; A11 31.75,-24.13; A12 34.29,-24.13; A13 36.83,-24.13; A14 39.37,-24.13; A15 41.91,-24.13; AREF -25.654,24.13; GND@0 -8.89,-24.13; GND@1 -6.35,-24.13; GND@2 44.45,-19.05; GND@3 46.99,-19.05; GND@4 -23.114,24.13; RESET -16.51,-24.13; VIN -3.81,-24.13 | drill 1.016 pad 1.88 octagon: 22 44.45,21.59; 23 46.99,21.59; 24 44.45,19.05; 25 46.99,19.05; 26 44.45,16.51; 27 46.99,16.51; 28 44.45,13.97; 29 46.99,13.97; 30 44.45,11.43; 31 46.99,11.43; 32 44.45,8.89; 33 46.99,8.89; 34 44.45,6.35; 35 46.99,6.35; 36 44.45,3.81; 37 46.99,3.81; 38 44.45,1.27; 39 46.99,1.27; 40 44.45,-1.27; 41 46.99,-1.27; 42 44.45,-3.81; 43 46.99,-3.81; 44 44.45,-6.35; 45 46.99,-6.35; 46 44.45,-8.89; 47 46.99,-8.89; 48 44.45,-11.43; 49 46.99,-11.43; 50 44.45,-13.97; 51 46.99,-13.97; 52 44.45,-16.51; 53 46.99,-16.51 | hole 3.2: -34.29,24.13; -35.56,-24.13; 16.51,8.89; 16.51,-19.05; 40.64,24.13; 46.99,-24.13
156120M173000 = smd 1.6 x 1.2: 1 -1.5,-0.8; 2 -1.5,0.8; 3 1.5,0.8; 4 1.5,-0.8
C1206 = smd 1.6 x 1.8: 1 -1.4,0; 2 1.4,0
XBEE3PRO_SMT_FOOTPRINT = smd 1.5 x 1.5: 1 -11.43,13.97; 2 -11.43,11.97; 3 -11.43,9.97; 4 -11.43,7.97; 5 -11.43,5.97; 6 -11.43,3.97; 7 -11.43,1.97; 8 -11.43,-0.03; 9 -11.43,-2.03; 10 -11.43,-4.03; 11 -11.43,-6.03; 12 -11.43,-8.03; 13 -11.43,-10.03; 14 -6.924,-12.638; 15 -4.924,-12.638; 16 -2.924,-12.638; 17 -0.924,-12.638; 18 1.076,-12.638; 19 3.076,-12.638; 20 5.076,-12.638; 21 7.076,-12.638; 22 11.586,-10.03; 23 11.586,-8.03; 24 11.586,-6.03; 25 11.586,-4.03; 26 11.586,-2.03; 27 11.586,-0.03; 28 11.586,1.97; 29 11.586,3.97; 30 11.586,5.97; 31 11.586,7.97; 32 11.586,9.97; 33 11.586,11.97; 34 11.586,13.97; 35 11.586,15.97; 36 11.586,17.97; 37 11.578,19.97 | smd 2.86 x 1.5: 1-1 -10.922,13.97; 2-1 -10.922,11.97; 3-1 -10.922,9.97; 4-1 -10.922,7.97; 5-1 -10.922,5.97; 6-1 -10.922,3.97; 7-1 -10.922,1.97; 8-1 -10.922,-0.03; 9-1 -10.922,-2.03; 10-1 -10.922,-4.03; 11-1 -10.922,-6.03; 12-1 -10.922,-8.03; 13-1 -10.922,-10.03; 22-1 11.078,-10.03; 23-1 11.078,-8.03; 24-1 11.078,-6.03; 25-1 11.078,-4.03; 26-1 11.078,-2.03; 27-1 11.078,-0.03; 28-1 11.078,1.97; 29-1 11.078,3.97; 30-1 11.078,5.97; 31-1 11.078,7.97; 32-1 11.078,9.97; 33-1 11.078,11.97; 34-1 11.078,13.97; 35-1 11.078,15.97; 36-1 11.078,17.97; 37-1 11.078,19.97 | smd 1.5 x 2.86: 14-1 -6.924,-12.13; 15-1 -4.924,-12.13; 16-1 -2.924,-12.13; 17-1 -0.924,-12.13; 18-1 1.076,-12.13; 19-1 3.076,-12.13; 20-1 5.076,-12.13; 21-1 7.076,-12.13 | smd 0.2 x 0.2: 38 -4.722,11.07 | drill 0.254 pad 0.508: 38-1 -4.822,11.07; 38-2 -5.722,11.07; 38-3 -3.922,11.07; 38-4 -3.922,11.97; 38-5 -5.722,11.97; 38-6 -4.822,11.97; 38-7 -3.922,10.07; 38-8 -5.722,10.07; 38-9 -4.822,10.07
SOIC127P600X175-8N = smd 1.525 x 0.65: 1 -2.712,1.905; 2 -2.712,0.635; 3 -2.712,-0.635; 4 -2.712,-1.905; 5 2.712,-1.905; 6 2.712,-0.635; 7 2.712,0.635; 8 2.712,1.905
TE_6473427-1 = drill 1.3 square: 1 -31.25,6.5 | drill 1.3: 2 -28.25,6.5; 3 -25.25,6.5; 4 -22.25,6.5; 5 -19.25,6.5; 6 -16.25,6.5; 7 -13.25,6.5; 8 -10.25,6.5; 9 -7.25,6.5; 10 -29.75,9; 11 -26.75,9; 12 -23.75,9; 13 -20.75,9; 14 -17.75,9; 15 -14.75,9; 16 -11.75,9; 17 -8.75,9; 18 -29.75,12; 19 -26.75,12; 20 -23.75,12; 21 -20.75,12; 22 -17.75,12; 23 -14.75,12; 24 -11.75,12; 25 -8.75,12; 26 -31.25,14.5; 27 -28.25,14.5; 28 -25.25,14.5; 29 -22.25,14.5; 30 -19.25,14.5; 31 -16.25,14.5; 32 -13.25,14.5; 33 -10.25,14.5; 34 -7.25,14.5; 35 7.25,6.5; 36 10.25,6.5; 37 13.25,6.5; 38 16.25,6.5; 39 19.25,6.5; 40 22.25,6.5; 41 25.25,6.5; 42 8.75,9; 43 11.75,9; 44 14.75,9; 45 17.75,9; 46 20.75,9; 47 23.75,9; 48 8.75,12; 49 11.75,12; 50 14.75,12; 51 17.75,12; 52 20.75,12; 53 23.75,12; 54 7.25,14.5; 55 10.25,14.5; 56 13.25,14.5; 57 16.25,14.5; 58 19.25,14.5; 59 22.25,14.5; 60 25.25,14.5 | hole 3.3: 0,0; -38.5,0; 32.5,0
CONN3_10S05_XPP = drill 0.991 pad 1.499: 1 0,0; 2 2.54,0; 3 5.08,0
1X04 = drill 1.016 pad 1.88 square: 1 0,0 | drill 1.016 pad 1.88: 2 2.54,0; 3 5.08,0; 4 7.62,0
SOT23-3 = smd 0.8 x 0.9: 1 -0.95,-1; 2 0.95,-1; 3 0,1.1
R1206 = smd 1.6 x 1.803: 1 -1.422,0; 2 1.422,0
LED_SML-LX1206SIC-TR_LUM = smd 1.168 x 1.499: 1 -1.372,0; 2 1.372,0
CTS_ELECTROCOMPONENTS_204-211ST_0 = smd 2.44 x 1.13: 1 -4.3,0; 2 4.3,0
SOT-25_TOR = smd 0.927 x 0.432: 1 -1.289,0.95; 2 -1.289,0; 3 -1.289,-0.95; 4 1.289,-0.95; 5 1.289,0.95
UNO_R3_SHIELD = drill 1.016 pad 1.88: 3.3V 50.8,26.67; 5V 50.8,29.21; A0 50.8,41.91; A1 50.8,44.45; A2 50.8,46.99; A3 50.8,49.53; A4 50.8,52.07; A5 50.8,54.61; AREF 2.54,15.24; D2 2.54,49.53; D3 2.54,46.99; D4 2.54,44.45; D5 2.54,41.91; D6 2.54,39.37; D7 2.54,36.83; D8 2.54,33.02; D9 2.54,30.48; D10 2.54,27.94; D11 2.54,25.4; D12 2.54,22.86; D13 2.54,20.32; GND@0 50.8,31.75; GND@1 50.8,34.29; GND@2 2.54,17.78; IOREF 50.8,21.59; NC 50.8,19.05; RES 50.8,24.13; RX 2.54,54.61; SCL 2.54,10.16; SDA 2.54,12.7; TX 2.54,52.07; VIN 50.8,36.83
PW0016A_N = smd 1.4 x 0.45: 1 -2.95,2.275; 2 -2.95,1.625; 3 -2.95,0.975; 4 -2.95,0.325; 5 -2.95,-0.325; 6 -2.95,-0.975; 7 -2.95,-1.625; 8 -2.95,-2.275; 9 2.95,-2.275; 10 2.95,-1.625; 11 2.95,-0.975; 12 2.95,-0.325; 13 2.95,0.325; 14 2.95,0.975; 15 2.95,1.625; 16 2.95,2.275

### Placement (x,y rotation side)
B1  66.04,58.42 180 bottom
BRAKEPRES  171.42,13.77 0 top
BRAKETEMP  151.13,6.15 0 top
C1  -33.02,-38.1 0 top  (outside the outline)
C2  -33.02,-41.91 0 top  (outside the outline)
C3  -33.02,-46.99 0 top  (outside the outline)
C4  -33.02,-50.8 0 top  (outside the outline)
C5  -33.02,-54.61 0 top  (outside the outline)
C6  -33.02,-59.69 0 top  (outside the outline)
C7  -33.02,-63.5 0 top  (outside the outline)
C8  -33.02,-67.31 0 top  (outside the outline)
C9  -33.02,-71.12 0 top  (outside the outline)
C10  -33.02,-74.93 0 top  (outside the outline)
C11  -33.02,-78.74 0 top  (outside the outline)
C12  -33.02,-82.55 0 top  (outside the outline)
C13  -33.02,-86.36 0 top  (outside the outline)
C14  -33.02,-90.17 0 top  (outside the outline)
C15  -33.02,-93.98 0 top  (outside the outline)
C16  -33.02,-97.79 0 top  (outside the outline)
C17  -33.02,-101.6 0 top  (outside the outline)
C18  -33.02,-105.41 0 top  (outside the outline)
C19  -33.02,-109.22 0 top  (outside the outline)
C20  -33.02,-113.03 0 top  (outside the outline)
C21  -33.02,-116.84 0 top  (outside the outline)
C22  -33.02,-120.65 0 top  (outside the outline)
C23  -33.02,-124.46 0 top  (outside the outline)
C24  -33.02,-128.27 0 top  (outside the outline)
C25  -33.02,-132.08 0 top  (outside the outline)
C26  -33.02,-135.89 0 top  (outside the outline)
C27  -33.02,-139.7 0 top  (outside the outline)
C28  -33.02,-143.51 0 top  (outside the outline)
C29  -33.02,-147.32 0 top  (outside the outline)
C30  -33.02,-151.13 0 top  (outside the outline)
C31  -33.02,-154.94 0 top  (outside the outline)
C32  -33.02,-158.75 0 top  (outside the outline)
C33  -33.02,-162.56 0 top  (outside the outline)
C34  -33.02,-166.37 0 top  (outside the outline)
C35  -33.02,-170.18 0 top  (outside the outline)
COOLANTTEMP  140.94,13.77 0 top
DAQ  156.21,26.47 0 top
DASH  161.29,6.15 0 top
E*1  135.89,105.41 0 top  (outside the outline)
IC1  55.02,41.38 0 top
INTAKEPRES  161.29,13.77 0 top
INTAKETEMP  151.13,13.77 0 top
J1  67.39,9.4 0 top
J2  12.95,7.47 0 top
JP1  186.49,63.22 0 top
LAMBDAS  171.45,6.15 0 top
OILPRES  171.45,21.39 0 top
OILTEMP  161.29,21.39 0 top
Q1  137.77,71.78 0 top
Q2  143.66,71.68 0 top
R1  -15.24,-19.05 0 top  (outside the outline)
R2  -15.24,-24.13 0 top  (outside the outline)
R3  -33.02,240.03 0 top  (outside the outline)
R4  -33.02,236.22 0 top  (outside the outline)
R5  -33.02,231.14 0 top  (outside the outline)
R6  -33.02,227.33 0 top  (outside the outline)
R7  -33.02,222.25 0 top  (outside the outline)
R8  -33.02,218.44 0 top  (outside the outline)
R9  -33.02,213.36 0 top  (outside the outline)
R10  -33.02,209.55 0 top  (outside the outline)
R11  161.21,4.8 180 bottom
R12  171.37,4.8 180 bottom
R13  151.05,4.8 180 bottom
R14  140.89,4.78 180 bottom
R15  171.35,12.4 180 bottom
R16  161.21,12.4 180 bottom
R17  151.05,12.4 180 bottom
R18  140.87,12.42 180 bottom
R19  171.37,20.02 180 bottom
R20  161.21,20.02 180 bottom
R21  151.05,20.02 180 bottom
R22  140.89,20.02 180 bottom
R23  156.13,25.1 180 bottom
R24  180.31,4.78 0 bottom
R25  -33.02,149.86 0 top  (outside the outline)
R26  -33.02,146.05 0 top  (outside the outline)
R27  -33.02,142.24 0 top  (outside the outline)
R28  -33.02,138.43 0 top  (outside the outline)
R29  -33.02,134.62 0 top  (outside the outline)
R30  -33.02,130.81 0 top  (outside the outline)
R31  -33.02,127 0 top  (outside the outline)
R32  -33.02,123.19 0 top  (outside the outline)
R33  -33.02,119.38 0 top  (outside the outline)
R34  -33.02,115.57 0 top  (outside the outline)
R35  -33.02,110.49 0 top  (outside the outline)
R36  -33.02,106.68 0 top  (outside the outline)
R37  -33.02,102.87 0 top  (outside the outline)
R38  -33.02,99.06 0 top  (outside the outline)
R39  -33.02,95.25 0 top  (outside the outline)
R40  -33.02,91.44 0 top  (outside the outline)
R41  -33.02,86.36 0 top  (outside the outline)
R42  -33.02,82.55 0 top  (outside the outline)
R43  -33.02,78.74 0 top  (outside the outline)
R44  -33.02,73.66 0 top  (outside the outline)
R45  -33.02,69.85 0 top  (outside the outline)
R46  -33.02,66.04 0 top  (outside the outline)
R47  -33.02,60.96 0 top  (outside the outline)
R48  -33.02,57.15 0 top  (outside the outline)
R49  -33.02,53.34 0 top  (outside the outline)
R50  -33.02,49.53 0 top  (outside the outline)
R51  -33.02,44.45 0 top  (outside the outline)
R52  -33.02,40.64 0 top  (outside the outline)
R53  -33.02,36.83 0 top  (outside the outline)
R54  -33.02,33.02 0 top  (outside the outline)
R55  -33.02,29.21 0 top  (outside the outline)
R56  -33.02,25.4 0 top  (outside the outline)
R57  -33.02,21.59 0 top  (outside the outline)
R58  -33.02,17.78 0 top  (outside the outline)
R59  -33.02,12.7 0 top  (outside the outline)
R60  -33.02,8.89 0 top  (outside the outline)
R61  -33.02,5.08 0 top  (outside the outline)
R62  -33.02,1.27 0 top  (outside the outline)
R63  -33.02,-2.54 0 top  (outside the outline)
R64  -33.02,-6.35 0 top  (outside the outline)
R65  -33.02,-10.16 0 top  (outside the outline)
R66  -33.02,-13.97 0 top  (outside the outline)
R67  -33.02,-17.78 0 top  (outside the outline)
R68  -33.02,-21.59 0 top  (outside the outline)
R69  -33.02,-25.4 0 top  (outside the outline)
R70  -33.02,-29.21 0 top  (outside the outline)
R71  119.38,8.89 180 bottom
REC  180.34,6.12 180 top
SHOCKPOT  140.97,6.17 0 top
SPARE1  151.13,21.39 0 top
SPARE2  140.97,21.36 0 top
SW1  110.49,6.35 0 top
SW2  110.49,8.89 0 top
U1  135.94,77.37 0 top
U4  151.13,22.86 0 top
U6  81.28,40.64 0 top
U7  96.06,40.61 0 top

### Tracks (layer width: path | path; a pad name or v marks a point on that pad's centre or on a via)
2AIC0  (via drill 0.35)  (2 unrouted)
  Top 0.152: 91.23,58.42 96.24,58.42 96.52,58.14 v96.52,45.44 | U7.11 97.93,39.64 v97.87,39.7
  Bottom 0.152: v96.52,45.44 96.52,40.16 96.98,39.7 v97.87,39.7
2AIC1  (via drill 0.35)  (2 unrouted)
  Top 0.152: 93.64,51.55 93.64,45.72 93.05,45.14 v90.14,45.14 | U6.11 v85.44,39.66
  Bottom 0.152: v90.14,45.14 87.07,45.14 85.44,43.5 v85.44,39.66
2AIC2  (via drill 0.35)  (2 unrouted)
  Top 0.152: v95.38,45.14 | U7.10 v97.87,38.99
  Bottom 0.152: v97.87,38.99 95.82,38.99 95.38,39.43 v95.38,45.14
2AIC3  (via drill 0.35)  (2 unrouted)
  Top 0.152: 91.38,46.99 91.38,49.47 91.14,49.71 | 91.38,46.99 v91.38,45.61 | 90.87,46.48 91.38,46.99 | v86.33,39.01 U6.10
  Bottom 0.152: v91.38,45.61 90.42,44.65 86.98,44.65 85.91,43.58 85.91,39.44 v86.33,39.01
3.3V  (10 unrouted)
3AIC0  (via drill 0.35)  (2 unrouted)
  Top 0.152: v92.6,44.14 92.36,44.37 80.58,44.37 78.74,46.21 | v91.92,38.99 U7.7
  Bottom 0.152: v92.6,44.14 92.6,39.67 v91.92,38.99
3AIC1  (via drill 0.35)  (2 unrouted)
  Top 0.152: v88.77,48.16 88.58,48.35 88.58,50.46 87.97,51.08 85.09,51.08 83.8,52.37 | v80.54,39.01 U6.7
  Bottom 0.152: v88.77,48.16 88.77,47.24 v80.54,39.01
3AIC2  (via drill 0.35)  (2 unrouted)
  Top 0.152: 78.28,52.1 79.35,51.03 79.73,51.03 80.29,50.47 80.29,45.06 80.7,44.65 v93.12,44.65 | v94.28,39.65 93.12,39.65 U7.6
  Bottom 0.152: v93.12,44.65 94.28,43.48 v94.28,39.65
3AIC3  (2 unrouted)
  Top 0.152: 72.29,44.65 72.97,43.97 74.91,43.97 75.41,43.46 75.41,40.28 76.03,39.66 U6.6
4
  Top 0.152: BRAKETEMP.4 152.63,3.13 152.15,2.64 127.92,2.64 124.44,6.13 124.44,19.5 113.55,30.38 73.76,30.38 B1.4
5
  Top 0.152: B1.5 71.5,30.1 113.44,30.1 124.16,19.38 124.16,6.01 127.8,2.36 160.86,2.36 161.31,2.82 161.31,6.07 160.44,6.95 DASH.2
5V  (via drill 0.35)  (26 unrouted)
  Top 0.152: J1.12 42.17,19.86 36.2,19.86 v35.56,19.23 | v23.09,19.23 16.18,19.23 v13.95,16.99 13.95,11.56 J2.3
  Bottom 0.152: v35.56,19.23 v23.09,19.23 | R12.2 172.8,3.81 172.8,3.53 172.8,3.3 | 152.48,3.3 157.56,3.3 | 162.64,3.3 157.56,3.3 | R11.2 162.64,3.3 | 162.64,3.3 | R13.2 152.48,3.3 | 152.48,3.3 | R18.2 142.29,11.3 142.82,10.77 152.48,10.77 | R15.2 172.77,11.1 172.44,10.77 162.64,10.77 | 162.64,10.77 157.56,10.77 | 152.48,10.77 157.56,10.77 | R17.2 152.48,10.77 | 152.48,10.77 | R16.2 162.64,10.77 | 162.64,10.77 | R22.2 142.32,18.82 142.7,18.44 152.48,18.44 | 152.48,18.44 157.56,18.44 | 157.56,18.44 162.64,18.44 | 162.64,18.44 172.44,18.44 172.8,18.8 R19.2 | R21.2 152.48,18.44 | R20.2 162.64,18.44 | R24.1 181.74,3.68 181.35,3.3 172.8,3.3 | R23.2 157.56,18.44 | 157.56,18.44 | 157.56,18.44 157.56,10.77 | 157.56,10.77 | 157.56,10.77 157.56,6.35 | 157.56,6.35 157.56,3.3 | 157.56,3.3 | 157.56,6.35 v156.54,6.35 | R14.2 142.32,3.63 142.65,3.3 152.48,3.3 | 162.64,3.3 172.8,3.3 | 172.8,3.3
  pour Top (rank 6): 0,88.9 204.47,88.9 204.47,0 0,0
5VOR0V  (via drill 0.35)  (5 unrouted)
  Top 0.152: v107.11,23.6 107.11,16.17 113.23,10.05 113.23,8.89 113.23,7.67 114.55,6.35 SW1.2 | 39.47,48.16 38.76,47.45 38.76,32.33 v38.99,32.11
  Bottom 0.152: v38.99,32.11 38.99,30.84 39.32,30.5 99.83,30.5 | v107.11,23.6 106.73,23.6
6
  Top 0.152: B1.6 69.24,29.82 113.32,29.82 123.88,19.27 123.88,5.89 127.69,2.08 160.97,2.08 161.59,2.7 161.59,6.07 162.47,6.95 DASH.3
7
  Top 0.152: B1.7 66.98,29.54 113.21,29.54 123.6,19.15 123.6,5.78 127.57,1.8 162.33,1.8 162.79,2.26 DASH.4
8
  Top 0.152: B1.8 63.2,29.26 113.09,29.26 123.32,19.04 123.32,5.66 127.46,1.52 170.81,1.52 171.45,2.16 171.45,6.07 170.57,6.95 LAMBDAS.2
9
  Top 0.152: B1.9 60.94,28.98 112.98,28.98 123.04,18.92 123.04,5.55 127.34,1.24 170.93,1.24 171.73,2.04 171.73,6.07 172.61,6.95 LAMBDAS.3
10
  Top 0.152: B1.10 58.67,28.7 112.86,28.7 122.76,18.8 122.76,5.43 127.22,0.96 172.39,0.96 172.95,1.52 LAMBDAS.4
12V  (via drill 0.35)  (1 unrouted)
  Top 0.152: 34.29,22.86 14.45,22.86 v13.95,22.35 12.95,21.36 J2.1
  Top 0.254: B1.VIN 62.23,81.28 60.76,79.81 27.74,79.81 25.35,77.42 25.35,48.01 26.53,46.84 37.06,46.84 37.21,46.69 37.21,26.67 | 37.21,26.67 37.21,24.97 J1.26 | 37.21,26.67 36.14,25.6 35.56,25.6 34.29,24.33 34.29,22.86 34.29,15.24 35.56,13.97 71.12,13.97 72.39,15.24 72.39,22.86 73.43,23.9 J1.54
14
  Top 0.152: B1.14 88.72,30.66 113.67,30.66 124.71,19.61 124.71,6.24 128.04,2.92 150.81,2.92 151.46,3.57 151.46,6.07 152.34,6.95 BRAKETEMP.3
15
  Top 0.152: B1.15 90.98,30.94 113.79,30.94 124.99,19.73 124.99,6.36 128.15,3.2 150.7,3.2 151.18,3.68 151.18,6.07 150.31,6.95 BRAKETEMP.2
16
  Top 0.152: B1.16 93.24,31.22 113.9,31.22 125.27,19.85 125.27,6.47 128.27,3.48 141.94,3.48 142.47,4.01 SHOCKPOT.4
17
  Top 0.152: B1.17 95.5,31.5 114.02,31.5 125.55,19.96 125.55,6.59 128.38,3.76 140.65,3.76 141.3,4.4 141.3,6.1 142.18,6.97 SHOCKPOT.3
18
  Top 0.152: B1.18 97.77,31.77 114.13,31.77 125.83,20.08 125.83,6.71 128.5,4.04 140.54,4.04 141.02,4.52 141.02,6.1 140.15,6.97 SHOCKPOT.2
19
  Top 0.152: B1.19 100.03,32.05 114.25,32.05 126.11,20.19 126.11,13.06 130.71,8.46 172.16,8.46 172.93,9.22 BRAKEPRES.4
22
  Top 0.152: BRAKEPRES.3 172.61,14.57 171.73,13.69 171.73,9.7 170.76,8.74 130.82,8.74 126.39,13.17 126.39,20.31 114.5,32.2 114.5,34.95 113.89,35.56 111.76,35.56 B1.22
23
  Top 0.152: BRAKEPRES.2 170.57,14.57 171.45,13.69 171.45,9.82 170.65,9.02 130.94,9.02 126.67,13.29 126.67,20.42 114.78,32.31 114.78,35.08 B1.23
24
  Top 0.152: INTAKEPRES.4 162.79,9.83 162.25,9.3 131.06,9.3 126.95,13.4 126.95,20.54 115.06,32.43 115.06,36.41 113.38,38.1 111.76,38.1 B1.24
25
  Top 0.152: INTAKEPRES.3 162.55,14.57 161.65,13.66 161.65,10.34 160.88,9.58 131.17,9.58 127.23,13.52 127.23,20.66 115.34,32.54 115.34,37.06 B1.25
26
  Top 0.152: INTAKEPRES.2 160.47,14.57 161.37,13.66 161.37,10.45 160.77,9.85 131.29,9.85 127.51,13.63 127.51,20.77 115.62,32.66 115.62,38.4 113.38,40.64 111.76,40.64 B1.26
27
  Top 0.152: INTAKETEMP.4 152.63,10.57 152.2,10.13 131.4,10.13 127.79,13.75 127.79,20.89 115.9,32.77 115.9,39.04 B1.27
28
  Top 0.152: INTAKETEMP.3 152.41,14.57 151.54,13.69 151.54,11 150.95,10.41 131.52,10.41 128.07,13.87 128.07,21 116.18,32.89 116.18,40.38 113.38,43.18 111.76,43.18 B1.28
29
  Top 0.152: INTAKETEMP.2 150.38,14.57 151.26,13.69 151.26,11.11 150.84,10.69 131.63,10.69 128.35,13.98 128.35,21.12 116.46,33.01 116.46,41.02 B1.29
30
  Top 0.152: COOLANTTEMP.4 142.44,11.25 142.16,10.97 131.75,10.97 128.63,14.1 128.63,20.19 128.63,20.31 128.63,21.23 116.74,33.12 116.74,42.36 113.38,45.72 111.76,45.72 B1.30
31
  Top 0.152: COOLANTTEMP.3 142.23,14.57 141.35,13.69 141.35,11.66 140.94,11.25 131.87,11.25 128.91,14.21 128.91,21.35 117.02,33.24 117.02,43 B1.31
32
  Top 0.152: COOLANTTEMP.2 140.19,14.57 141.07,13.69 141.07,11.77 140.83,11.53 131.98,11.53 129.18,14.33 129.18,21.47 117.3,33.35 117.3,44.34 113.38,48.26 111.76,48.26 B1.32
33
  Top 0.152: OILPRES.4 172.95,17.05 172.34,16.43 131.72,16.43 129.46,18.69 129.46,21.58 117.58,33.47 117.58,44.98 B1.33
34
  Top 0.152: OILPRES.3 172.63,22.19 171.78,21.34 171.78,17.37 171.12,16.71 131.84,16.71 129.74,18.81 129.74,21.7 117.86,33.58 117.86,46.32 113.38,50.8 111.76,50.8 B1.34
35
  Top 0.152: OILPRES.2 170.65,22.19 171.5,21.34 171.5,17.49 171,16.99 131.96,16.99 130.02,18.93 130.02,21.81 118.14,33.7 118.14,46.97 B1.35
36
  Top 0.152: OILTEMP.4 162.79,17.81 162.25,17.27 132.07,17.27 130.3,19.04 130.3,21.93 118.41,33.82 118.41,48.3 113.38,53.34 111.76,53.34 B1.36
37
  Top 0.152: OILTEMP.3 162.52,22.19 161.65,21.31 161.65,18.14 161.06,17.55 132.19,17.55 130.58,19.16 130.58,22.05 118.69,33.93 118.69,48.95 B1.37
38
  Top 0.152: OILTEMP.2 160.49,22.19 161.37,21.31 161.37,18.28 160.92,17.83 132.3,17.83 130.86,19.27 130.86,22.16 118.97,34.05 118.97,50.28 113.38,55.88 111.76,55.88 B1.38
39
  Top 0.152: SPARE1.4 152.63,18.62 152.12,18.11 132.42,18.11 131.14,19.39 131.14,22.28 119.25,34.16 119.25,50.93 B1.39
40
  Top 0.152: SPARE1.3 152.36,22.19 151.49,21.31 151.49,18.87 151,18.39 132.53,18.39 131.42,19.5 131.42,22.39 119.53,34.28 119.53,52.26 113.38,58.42 111.76,58.42 B1.40
41
  Top 0.152: SPARE1.2 150.33,22.19 151.21,21.31 151.21,19.01 150.86,18.67 132.65,18.67 131.7,19.62 131.7,22.51 119.81,34.39 119.81,52.91 B1.41
42
  Top 0.152: SPARE2.4 142.47,19.48 141.94,18.95 132.77,18.95 131.98,19.74 131.98,22.62 120.09,34.51 120.09,54.24 113.38,60.96 111.76,60.96 B1.42
43
  Top 0.152: SPARE2.3 142.15,22.16 141.28,21.28 141.28,19.71 140.79,19.23 132.88,19.23 132.26,19.85 132.26,22.74 120.37,34.63 120.37,54.89 B1.43
44
  Top 0.152: SPARE2.2 140.12,22.16 141,21.28 141,19.94 140.56,19.51 133,19.51 132.54,19.97 132.54,22.85 120.65,34.74 120.65,56.23 113.38,63.5 111.76,63.5 B1.44
45
  Top 0.152: DAQ.4 157.71,23.85 157.25,23.39 132.39,23.39 120.93,34.86 120.93,56.87 B1.45
46
  Top 0.152: DAQ.3 157.39,27.27 156.49,26.36 156.49,24.38 155.78,23.67 132.51,23.67 121.21,34.97 121.21,58.21 113.38,66.04 111.76,66.04 B1.46
47
  Top 0.152: DAQ.2 155.31,27.27 156.21,26.36 156.21,24.5 155.66,23.95 132.62,23.95 121.49,35.09 121.49,58.85 B1.47
48  (via drill 0.35)
  Top 0.152: v114.78,13.92 SW2.2
  Bottom 0.152: B1.48 109.63,69.85 109.07,69.29 109.07,16.76 111.91,13.92 v114.78,13.92 117.35,13.92 117.96,13.31 R71.1
A0  (2 unrouted)
  Top 0.152: B1.A0 70.59,79.27
A0IN  (via drill 0.35)  (1 unrouted)
  Top 0.152: v67.21,68.25 67.21,73.91
  Bottom 0.152: v67.21,68.25 66.77,68.69 66.02,68.69 64.45,70.26 25.54,70.26 22.4,67.11 22.4,21.74 22.75,21.4 J1.18
A1  (2 unrouted)
  Top 0.152: B1.A1 71.58,80.82 71.58,74.2 73.69,72.08 75.64,72.08 76.19,71.54 77.03,71.54
A1IN  (via drill 0.35)  (1 unrouted)
  Top 0.152: 75.92,67.82 v76.48,67.26
  Bottom 0.152: v76.48,67.26 74.74,68.99 66.14,68.99 64.58,70.56 25.42,70.56 22.12,67.27 22.12,20.47 22.4,20.19 39.43,20.19 J1.19
A2  (2 unrouted)
  Top 0.152: 80.26,66.52 80.26,70.26 78.7,71.82 76.34,71.82 75.7,72.45 74.16,72.45 73.66,72.96 73.66,81.28 B1.A2
A2IN  (via drill 0.35)  (1 unrouted)
  Top 0.152: v73.66,69.6 74.03,69.23 74.03,62.81 75.24,61.59
  Bottom 0.152: v73.66,69.6 73.36,69.9 65.67,69.9 64.7,70.87 25.29,70.87 21.84,67.42 21.84,20.36 22.29,19.91 42.15,19.91 J1.20
A3  (2 unrouted)
  Top 0.152: 82.03,66.94 82.03,68.51 81.8,68.73 80.77,68.73 80.54,68.96 80.54,70.37 78.82,72.1 76.49,72.1 75.86,72.73 74.28,72.73 73.94,73.07 73.94,81.56 B1.A3
A3IN  (via drill 0.35)  (1 unrouted)
  Top 0.152: v80.03,63.08 80.24,63.08
  Bottom 0.152: v80.03,63.08 78.72,64.39 78.72,65.88 74.39,70.21 70.74,70.21 65.79,70.21 64.83,71.17 25.16,71.17 21.46,67.47 21.46,18.72 21.79,18.4 J1.10
A4  (2 unrouted)
  Top 0.152: 84.36,71.91 83.88,72.38 77.11,72.38 76.62,72.87 76.62,74.28 74.42,76.48 74.42,79.5 B1.A4
A4IN  (via drill 0.35)  (1 unrouted)
  Top 0.152: v79.33,64.64 81.14,66.45
  Bottom 0.152: v79.33,64.64 79.33,65.82 73.37,71.78 24.91,71.78 20.85,67.72 20.85,16.28 21.24,15.9 J1.1
A5  (2 unrouted)
  Top 0.152: B1.A5 75.34,77.88
A5IN  (via drill 0.35)  (1 unrouted)
  Top 0.152: v66.04,70.82 v66.04,75.79 | 74.87,73.95 74.87,75.34 v74.44,75.77
  Bottom 0.152: v74.44,75.77 66.06,75.77 v66.04,75.79 | v66.04,70.82 65.38,71.48 25.04,71.48 21.16,67.59 21.16,17.5 21.49,17.17 39.41,17.17 J1.11
A6  (2 unrouted)
  Top 0.152: B1.A6 82.55,81.28 80.01,78.74 80.01,77.5
A6IN  (via drill 0.35)  (1 unrouted)
  Top 0.152: v80.54,75.16 80.75,74.95
  Bottom 0.152: J1.9 60.14,12.03 59.61,11.51 19.62,11.51 17.48,13.65 17.48,69.12 23.52,75.16 v80.54,75.16
A7  (2 unrouted)
  Top 0.152: 89.05,66.22 89.05,68.04 88.05,69.04 86.56,69.04 86.25,69.35 86.25,71.06 85.09,72.21 B1.A7
A7IN  (via drill 0.35)  (1 unrouted)
  Top 0.152: v87.48,62.84 87.84,62.48
  Bottom 0.152: J1.17 58.64,12.26 58.17,11.79 19.74,11.79 17.76,13.77 17.76,69 23.63,74.88 74.68,74.88 82.76,66.81 82.76,65.38 85.3,62.84 v87.48,62.84
A8  (2 unrouted)
  Top 0.152: 90.05,71.47 88.51,73.01 88.51,78.75 90.17,80.42 B1.A8
A8IN  (via drill 0.35)  (1 unrouted)
  Top 0.152: v85.63,67.82 87,67.82
  Bottom 0.152: v85.63,67.82 v85.62,67.82 85.62,65.55 88.08,63.09 88.08,62.18 87.91,62 85.74,62 82.48,65.27 82.48,66.69 74.57,74.6 23.75,74.6 18.03,68.89 18.03,13.88 19.85,12.06 56.62,12.06 57.14,12.58 J1.8
A9  (2 unrouted)
  Top 0.152: 94.77,63.25 92.2,63.25 91.77,63.68 91.77,70.79 90.97,71.59 90.32,71.59 88.78,73.12 88.78,78.62 B1.A9
A9IN  (via drill 0.35)  (1 unrouted)
  Top 0.152: v93.12,62.69 93.12,61.32
  Bottom 0.152: J1.16 55.64,12.95 55.03,12.34 19.97,12.34 18.31,14 18.31,68.77 23.87,74.33 74.45,74.33 82.2,66.58 82.2,65.15 85.63,61.72 92.15,61.72 v93.12,62.69
A10  (via drill 0.35)  (2 unrouted)
  Top 0.152: B1.A10 93.95,81.25 91.83,81.25 89.09,78.51 89.09,73.25 89.22,73.11 90.84,73.11 91.56,72.39 v92.71,72.39 | v95.05,69.52 95.03,69.51 95.03,66.9 95.17,66.76 96.96,66.76 97.09,66.9 97.09,68.51 97.66,69.08 99.45,69.08 99.58,68.94 99.58,67.05 101.3,65.34
  Bottom 0.152: v95.05,69.52 92.71,71.86 v92.71,72.39
A10IN  (via drill 0.35)  (1 unrouted)
  Top 0.152: 97.97,61.7 v97.97,62.97
  Bottom 0.152: v97.97,62.97 97.92,63.02 96.34,61.44 85.51,61.44 81.92,65.03 81.92,66.46 74.34,74.05 23.98,74.05 18.59,68.66 18.59,14.12 20.09,12.62 53.59,12.62 54.14,13.17 J1.7
A11  (2 unrouted)
  Top 0.152: B1.A11 96.22,80.97 91.97,80.97 90.17,79.18
A11IN  (via drill 0.35)  (1 unrouted)
  Top 0.152: v87.25,72.77 87.25,74.19
  Bottom 0.152: v87.25,72.77 87.22,72.75 96.4,63.57 98.22,63.57 98.62,63.17 98.62,62.69 97.09,61.16 85.39,61.16 81.64,64.92 81.64,66.35 74.22,73.77 24.1,73.77 18.87,68.54 18.87,14.23 20.2,12.9 50.55,12.9 51.14,13.49 J1.6
A12  (2 unrouted)
  Top 0.152: B1.A12 100.33,81.28 98.4,79.35 94.78,79.35 93.98,78.55 93.98,72.9
A12IN  (via drill 0.35)  (1 unrouted)
  Top 0.152: v92.84,69.37 92.84,68.13
  Bottom 0.152: v92.84,69.37 92.8,69.33 91.81,70.32 91.81,75.66 92.81,76.65 98.33,76.65 99.46,75.53 99.46,62.31 97.48,60.33 85.05,60.33 80.8,64.57 80.8,66 73.87,72.93 24.45,72.93 19.71,68.19 19.71,14.58 20.55,13.74 46.05,13.74 46.64,14.32 J1.13
A13  (2 unrouted)
  Top 0.152: B1.A13 102.87,81.59 100.33,79.04 94.88,79.04 94.27,78.44 94.27,73.02 95.24,72.05 100.28,72.05 101.47,70.85
A13IN  (via drill 0.35)  (1 unrouted)
  Top 0.152: v97.52,66.14 98.58,67.21
  Bottom 0.152: v97.52,66.14 94.26,66.14 91.51,68.89 91.51,75.75 92.69,76.93 98.45,76.93 99.74,75.64 99.74,62.19 97.59,60.05 84.93,60.05 80.52,64.46 80.52,65.88 73.76,72.65 24.56,72.65 19.99,68.08 19.99,14.7 20.67,14.02 43.26,14.02 J1.4
A14  (2 unrouted)
  Top 0.152: B1.A14 101.6,78.74 97.03,78.74
A14IN  (via drill 0.35)  (1 unrouted)
  Top 0.152: v92.71,75.9 92.71,74.33
  Bottom 0.152: J1.5 48.14,14.09 47.5,13.46 20.43,13.46 19.43,14.46 19.43,68.31 24.33,73.21 73.99,73.21 81.08,66.12 81.08,64.69 85.16,60.6 97.33,60.6 99.18,62.46 99.18,75.41 98.22,76.38 93.19,76.38 v92.71,75.9
A15  (2 unrouted)
  Top 0.152: B1.A15 102.79,77.39
A15IN  (via drill 0.35)  (1 unrouted)
  Top 0.152: v97.99,75.64 97.99,74.33
  Bottom 0.152: v97.99,75.64 97.99,64.23 98.91,63.32 98.91,62.58 97.21,60.88 85.28,60.88 81.36,64.8 81.36,66.23 74.1,73.49 24.21,73.49 19.15,68.43 19.15,14.35 20.32,13.18 49.05,13.18 49.64,13.77 J1.14
CALIB  (2 unrouted)
  Top 0.152: B1.13 45.47,32.89 | 51.14,27.22 J1.31
CAN_CS
  Bottom 0.152: U4.D10 155.02,49.45 155.02,47.6 154.41,46.99 116.1,46.99 115.21,47.88 115.21,69.42 114.78,69.85 B1.49
CANHI
  Bottom 0.152: J1.60 95.05,21.49 95.05,3.16 96.23,1.98 190.86,1.98 191.57,2.69 JP1.3
CANLO
  Bottom 0.152: J1.53 94.77,17.77 94.77,3.05 96.11,1.7 192.66,1.7 194.11,3.15 JP1.4
DIN  (3 unrouted)
DOUT  (3 unrouted)
FL_WS  (2 unrouted)
  Top 0.152: J1.25 58.83,21.59 61.06,21.59 61.7,22.22 | 74.93,32.58 B1.2
FR_WS  (2 unrouted)
  Top 0.152: B1.3 72.39,32.66
GND  (via drill 0.35)  (61 unrouted)
  Top 0.152: v76.28,40.94 76.3,40.97 U6.4 U6.5 | v91.39,41.6 92.05,40.94 U7.4 U7.5 | 91.39,41.84 v91.39,41.6 | v91.39,41.6 91.39,38.58 90.75,37.95 | IC1.4 v49.73,39.47 | v7.62,5.08 7.62,6.07 14.1,6.07 J2.2
  pour Bottom: 0,88.9 204.47,88.9 204.47,0 0,0
LCL  (3 unrouted)
  Top 0.152: 60.32,36.79 58.74,38.38 56.49,38.38 56.19,38.68 56.19,41.58 56.62,42.01 | J1.48 76.2,21.4 | 76.2,21.4 J1.49 80.39,22.66 82.39,22.66 J1.57 | J1.35 J1.36 J1.37 J1.38 | J1.38 J1.39 J1.40 J1.41 | J1.38 82.14,17.4 J1.44 | J1.44 J1.43 J1.42 76.2,18.46 76.2,21.4 | J1.44 J1.45 J1.46 J1.47
  Bottom 0.152: J1.57 77.77,29.77 59.41,29.77
LDA  (3 unrouted)
  Top 0.152: 47.12,38.86 47.88,38.1 58.62,38.1 60.05,36.68
  Bottom 0.152: J1.32 58.12,27.88 58.12,29.84
MISO
  Bottom 0.152: U4.D12 116.15,45.72 114.94,46.94 114.94,67.89 114.25,68.58 112.27,68.58 111.73,69.11 111.73,71.14 B1.50
MOSI
  Bottom 0.152: U4.D11 116.15,48.26 115.49,48.92 115.49,71.86 114.96,72.39 B1.51
N$1  (via drill 0.35)
  Top 0.152: v158.12,12.39 158.69,12.97 INTAKEPRES.1
  Bottom 0.152: R16.1 v158.12,12.39
N$2  (2 unrouted)
N$3  (via drill 0.35)
  other vias: 14,19.69
N$4  (via drill 0.35)
  Top 0.152: v158.14,4.8 158.69,5.35 DASH.1
  Bottom 0.152: R11.1 v158.14,4.8
N$5  (via drill 0.35)
  Top 0.152: v147.98,12.39 148.55,12.97 INTAKETEMP.1
  Bottom 0.152: R17.1 v147.98,12.39
N$6  (via drill 0.35)
  Top 0.152: v137.82,12.42 138.37,12.97 COOLANTTEMP.1
  Bottom 0.152: R18.1 v137.82,12.42
N$7  (via drill 0.35)
  Top 0.152: v168.28,20.02 168.85,20.59 OILPRES.1
  Bottom 0.152: R19.1 v168.28,20.02
N$8  (via drill 0.35)
  Top 0.152: v158.09,20.02 158.66,20.59 OILTEMP.1
  Bottom 0.152: R20.1 v158.09,20.02
N$9  (via drill 0.35)
  Top 0.152: v147.93,20.02 148.5,20.59 SPARE1.1
  Bottom 0.152: R21.1 v147.93,20.02
N$10  (via drill 0.35)
  Top 0.152: v137.82,20.02 138.37,20.56 SPARE2.1
  Bottom 0.152: R22.1 v137.82,20.02
N$11  (via drill 0.35)
  Top 0.152: v153.06,25.09 153.63,25.67 DAQ.1
  Bottom 0.152: R23.1 v153.06,25.09
N$12  (via drill 0.35)
  Top 0.152: v177.16,4.77 178.51,6.12 REC.2
  Bottom 0.152: R24.2 v177.16,4.77
N$13  (2 unrouted)
N$15  (1 unrouted)
  Top 0.152: U6.14 85.93,41.61 87.16,40.39
N$16  (2 unrouted)
N$17  (via drill 0.35)
  Top 0.152: v168.3,4.8 168.85,5.35 LAMBDAS.1
  Bottom 0.152: R12.1 v168.3,4.8
N$18  (via drill 0.35)
  Top 0.152: v147.98,4.8 148.53,5.35 BRAKETEMP.1
  Bottom 0.152: R13.1 v147.98,4.8
N$19  (via drill 0.35)
  Top 0.152: v137.77,4.77 138.37,5.37 SHOCKPOT.1
  Bottom 0.152: R14.1 v137.77,4.77
N$20  (via drill 0.35)
  Top 0.152: v168.28,12.39 168.85,12.97 BRAKEPRES.1
  Bottom 0.152: R15.1 v168.28,12.39
N$24  (2 unrouted)
N$32  (2 unrouted)
N$35  (via drill 0.35)  (1 unrouted)
  Top 0.152: v100.18,41.71 100.06,41.59 U7.14
  Bottom 0.152: v99.64,46.18 100.18,45.64 v100.18,41.71
N$40  (2 unrouted)
N$42  (1 unrouted)
  Top 0.152: U6.9 83.61,37.74 74.77,37.74
N$43  (1 unrouted)
  Top 0.152: 76.51,38.36 U6.8
N$44  (1 unrouted)
  Top 0.152: U7.9 99.23,38.56 99.66,38.56 99.92,38.81 99.92,39.24 100.82,40.15
N$45  (via drill 0.35)  (1 unrouted)
  Top 0.152: v93.95,37.57 93.89,37.57 U7.8 | v99.67,37.57 100.13,38.02
  Bottom 0.152: v93.95,37.57 v99.67,37.57
N$47  (2 unrouted)
REC  (1 unrouted)
  Top 0.152: B1.11 56.41,28.42 57.12,28.42 | J1.33 57.14,28.41 57.12,28.42 | 57.12,28.42 112.75,28.42 122.48,18.69 122.48,5.32 127.11,0.69 181.18,0.69 181.71,1.22 REC.1
RX0  (via drill 0.35)  (1 unrouted)
  Top 0.152: B1.0 81.71,35.99 101.21,35.99 v102.08,36.85 | v115.88,79.96 115.88,87 116.57,87.69 133.74,87.69 134.84,86.59 135.89,87.63 142.52,87.63 143.03,87.12 143.03,73.41 Q2.3
  Bottom 0.152: v115.88,79.96 115.77,79.86 106.05,79.86 105.41,79.22 105.41,37.26 105,36.85 v102.08,36.85
SCK
  Bottom 0.152: B1.52 111.76,76.2 116.14,76.2 116.64,76.7 116.64,83.36 117.41,84.12 155.06,84.12 156.49,82.69 156.49,43.87 155.8,43.18 U4.D13
SCL  (via drill 0.35)
  Top 0.152: v79.96,42.27 U6.2 v76.28,42.27 | v82.42,42.93 82.43,42.91 U6.16 85.33,44.02 91.98,44.02 U7.1 U7.16 | v66.7,42.27 65.18,40.74 IC1.6
  Bottom 0.152: B1.21 101.32,35.84 83.82,35.84 81.2,38.46 80.34,38.46 79.96,38.84 v79.96,42.27 81.15,42.27 81.81,42.93 v82.42,42.93 | v76.28,42.27 v66.7,42.27
SD_CS
  Bottom 0.152: B1.53 116.59,74.93 116.94,75.29 116.94,83.26 117.53,83.84 123.19,83.84 154.94,83.84 156.21,82.57 156.21,53.8 155.75,53.34 U4.D9
SDA  (via drill 0.35)
  Top 0.152: B1.20 102.79,36.75 102.79,41.91 102.46,42.24 U7.15 U7.2 93.06,42.29 v91.9,42.29 | v86.39,42.29 86.36,42.27 U6.15 81.13,42.27 80.48,42.91 U6.1 76.41,42.91 v76.28,43.05 | v66.7,43.03 60.12,43.03 59.21,43.94 56.13,43.94 52.93,40.74 IC1.3
  Bottom 0.152: v86.39,42.29 v91.9,42.29 | v76.28,43.05 66.73,43.05 v66.7,43.03
SG_11  (2 unrouted)
  Top 0.152: J1.30 46.35,25.68 39.12,25.68 38.48,26.32 38.48,47.39 37.77,48.11 27.05,48.11 26.62,48.54 26.62,50.29 26.91,50.58 30.97,50.58 31.28,50.89 38.1,50.89 39.47,52.26
SG_21  (2 unrouted)
  Top 0.152: 34.46,51.19 31.15,51.19 30.85,50.89 26.78,50.89 26.31,50.42 26.31,48.41 26.93,47.8 37.64,47.8 38.18,47.27 38.18,26.23 39,25.4 43.63,25.4 J1.29
SG_31  (2 unrouted)
  Top 0.152: 30.67,51.19 26.66,51.19 26.01,50.55 26.01,48.29 26.8,47.5 37.49,47.5 37.87,47.11 37.87,26.14 38.91,25.09 40.94,25.09 J1.28
SG_41  (2 unrouted)
  Top 0.152: J1.27 37.57,25.47 37.57,46.99 37.36,47.19 26.67,47.19 25.7,48.16 25.7,51.79 26.26,52.35
TX0  (via drill 0.35)  (1 unrouted)
  Top 0.152: B1.1 79.65,36.47 v100.18,36.47 | 139.98,85.01 139.98,77.04 139.14,76.2 139.14,73.35 138.67,72.88 Q1.3 137.75,72.9 v136.55,72.9 | v116.1,78.72 116.13,78.74 v118.11,78.74
  Bottom 0.152: v116.1,78.72 107.37,78.72 106.68,78.03 106.68,36.73 106.3,36.35 100.3,36.35 v100.18,36.47 | v118.11,78.74 123.01,78.74 125.07,76.68 132.77,76.68 v136.55,72.9
(copper drawn outside any net)
  shapes: Top area x2

### Text on the board
tPlace: 3.3V | 12V | GND | 5V
bPlace: Northwestern Formula Racing | Data Acquisition | Alex Kang, Jack Burkhardt | 2021-2022
tNames: CAN-BUS shield
Measures: Units: inches
tDocu: A. Weiss | Revised by: Patrick Alberts